# Altium project multimodal_hw_00.PrjPcb (part 1 of 2)
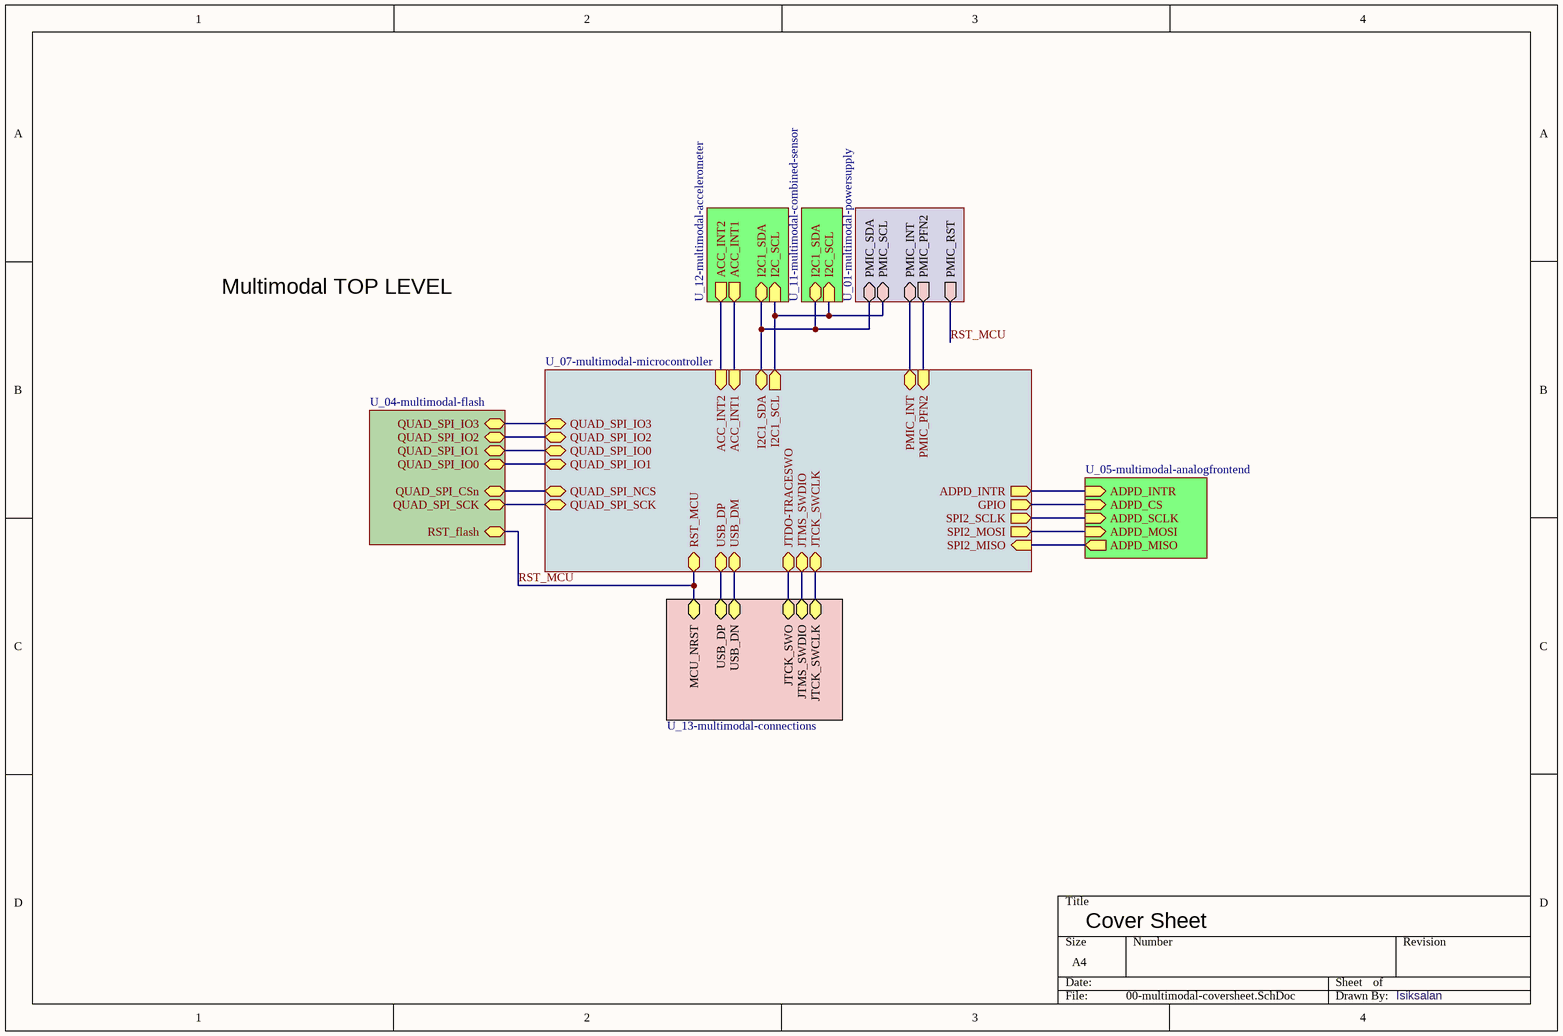
[diagram p0: 00-multimodal-coversheet.SchDoc]
11 sheets, 157 parts. Net scope: hierarchical (ports join the sheet entries above them; power ports are global).
Board file: Multimodal.PcbDoc
Sheets:
  00-multimodal-coversheet.SchDoc
    U_05-multimodal-analogfrontend = 05-multimodal-analogfrontend.SchDoc
      U_06-multimodal-analogfrontend-PPG = 06-multimodal-analogfrontend-PPG.SchDoc
    U_13-multimodal-connections = 13-multimodal-connections.SchDoc
    U_12-multimodal-accelerometer = 12-multimodal-accelerometer.SchDoc
    U_11-multimodal-combined-sensor = 11-multimodal-combined-sensor.SchDoc
    U_04-multimodal-flash = 04-multimodal-flash.SchDoc
    U_01-multimodal-powersupply = 01-multimodal-powersupply.SchDoc
    U_07-multimodal-microcontroller = 07-multimodal-microcontroller.SchDoc
      U_08-multimodal-microcontroller-oscillators = 08-multimodal-microcontroller-oscillators.SchDoc
      U_10-multimodal-microcontroller-rf = 10-multimodal-microcontroller-rf.SchDoc

## Sheet 00-multimodal-coversheet.SchDoc
size A4; SheetNumber: 1; SheetTotal: 11

### Sub-sheets
U_01-multimodal-powersupply = 01-multimodal-powersupply.SchDoc: PMIC_RST (out), PMIC_SDA (bidir), PMIC_SCL (bidir), PMIC_PFN2 (out), PMIC_INT (bidir)
U_04-multimodal-flash = 04-multimodal-flash.SchDoc: QUAD_SPI_CSn (bidir), QUAD_SPI_SCK (bidir), QUAD_SPI_IO0 (bidir), QUAD_SPI_IO1 (bidir), QUAD_SPI_IO2 (bidir), QUAD_SPI_IO3 (bidir), RST_flash (bidir)
U_05-multimodal-analogfrontend = 05-multimodal-analogfrontend.SchDoc: ADPD_INTR (in), ADPD_CS (in), ADPD_SCLK (in), ADPD_MISO (out), ADPD_MOSI (in)
U_07-multimodal-microcontroller = 07-multimodal-microcontroller.SchDoc: QUAD_SPI_IO3 (bidir), QUAD_SPI_IO2 (bidir), QUAD_SPI_IO0 (bidir), QUAD_SPI_IO1 (bidir), SPI2_MOSI (out), SPI2_MISO (in), SPI2_SCLK (out), I2C1_SCL (out), I2C1_SDA (bidir), USB_DP (bidir), USB_DM (bidir), QUAD_SPI_NCS (bidir), QUAD_SPI_SCK (bidir), JTDO-TRACESWO (bidir), JTCK_SWCLK (bidir), JTMS_SWDIO (bidir), RST_MCU (bidir), GPIO (out), ADPD_INTR (out), ACC_INT2 (in), ACC_INT1 (in), PMIC_PFN2 (in), PMIC_INT (bidir)
U_11-multimodal-combined-sensor = 11-multimodal-combined-sensor.SchDoc: I2C1_SDA (bidir), I2C_SCL (in)
U_12-multimodal-accelerometer = 12-multimodal-accelerometer.SchDoc: ACC_INT1 (out), ACC_INT2 (out), I2C1_SDA (bidir), I2C_SCL (in)
U_13-multimodal-connections = 13-multimodal-connections.SchDoc: JTCK_SWCLK (bidir), USB_DN (bidir), USB_DP (bidir), JTMS_SWDIO (bidir), MCU_NRST (bidir), JTCK_SWO (bidir)

### Nets
ACC_INT1: sheet U_12-multimodal-accelerometer/ACC_INT1, sheet U_07-multimodal-microcontroller/ACC_INT1
ACC_INT2: sheet U_12-multimodal-accelerometer/ACC_INT2, sheet U_07-multimodal-microcontroller/ACC_INT2
ADPD_INTR: sheet U_05-multimodal-analogfrontend/ADPD_INTR, sheet U_07-multimodal-microcontroller/ADPD_INTR
I2C1_SCL: sheet U_12-multimodal-accelerometer/I2C_SCL, sheet U_11-multimodal-combined-sensor/I2C_SCL, sheet U_01-multimodal-powersupply/PMIC_SCL, sheet U_07-multimodal-microcontroller/I2C1_SCL
I2C1_SDA: sheet U_12-multimodal-accelerometer/I2C1_SDA, sheet U_11-multimodal-combined-sensor/I2C1_SDA, sheet U_01-multimodal-powersupply/PMIC_SDA, sheet U_07-multimodal-microcontroller/I2C1_SDA
INT: sheet U_01-multimodal-powersupply/PMIC_INT, sheet U_07-multimodal-microcontroller/PMIC_INT
PFN2: sheet U_01-multimodal-powersupply/PMIC_PFN2, sheet U_07-multimodal-microcontroller/PMIC_PFN2
QUAD_SPI_CSn: sheet U_04-multimodal-flash/QUAD_SPI_CSn, sheet U_07-multimodal-microcontroller/QUAD_SPI_NCS
QUAD_SPI_IO0: sheet U_04-multimodal-flash/QUAD_SPI_IO0, sheet U_07-multimodal-microcontroller/QUAD_SPI_IO1
QUAD_SPI_IO1: sheet U_04-multimodal-flash/QUAD_SPI_IO1, sheet U_07-multimodal-microcontroller/QUAD_SPI_IO0
QUAD_SPI_IO2: sheet U_04-multimodal-flash/QUAD_SPI_IO2, sheet U_07-multimodal-microcontroller/QUAD_SPI_IO2
QUAD_SPI_IO3: sheet U_04-multimodal-flash/QUAD_SPI_IO3, sheet U_07-multimodal-microcontroller/QUAD_SPI_IO3
QUAD_SPI_SCK: sheet U_04-multimodal-flash/QUAD_SPI_SCK, sheet U_07-multimodal-microcontroller/QUAD_SPI_SCK
RST_MCU: sheet U_13-multimodal-connections/MCU_NRST, sheet U_04-multimodal-flash/RST_flash, sheet U_01-multimodal-powersupply/PMIC_RST, sheet U_07-multimodal-microcontroller/RST_MCU
NetCR1_1: sheet U_13-multimodal-connections/USB_DP, sheet U_07-multimodal-microcontroller/USB_DP
NetCR1_3: sheet U_13-multimodal-connections/USB_DN, sheet U_07-multimodal-microcontroller/USB_DM
NetJ1_02: sheet U_13-multimodal-connections/JTMS_SWDIO, sheet U_07-multimodal-microcontroller/JTMS_SWDIO
NetJ1_04: sheet U_13-multimodal-connections/JTCK_SWCLK, sheet U_07-multimodal-microcontroller/JTCK_SWCLK
NetJ1_06: sheet U_13-multimodal-connections/JTCK_SWO, sheet U_07-multimodal-microcontroller/JTDO-TRACESWO
NetR24_1: sheet U_05-multimodal-analogfrontend/ADPD_CS, sheet U_07-multimodal-microcontroller/GPIO
NetU5_A1: sheet U_05-multimodal-analogfrontend/ADPD_SCLK, sheet U_07-multimodal-microcontroller/SPI2_SCLK
NetU5_B1: sheet U_05-multimodal-analogfrontend/ADPD_MISO, sheet U_07-multimodal-microcontroller/SPI2_MISO
NetU5_B2: sheet U_05-multimodal-analogfrontend/ADPD_MOSI, sheet U_07-multimodal-microcontroller/SPI2_MOSI

### Notes on the sheet
- Multimodal TOP LEVEL
- Cover Sheet
- Isiksalan

## Sheet 05-multimodal-analogfrontend.SchDoc
size A3; CompanyName: ICAS Lab.; DrawnBy: Isil Isiksalan; SheetNumber: 3; SheetTotal: 11
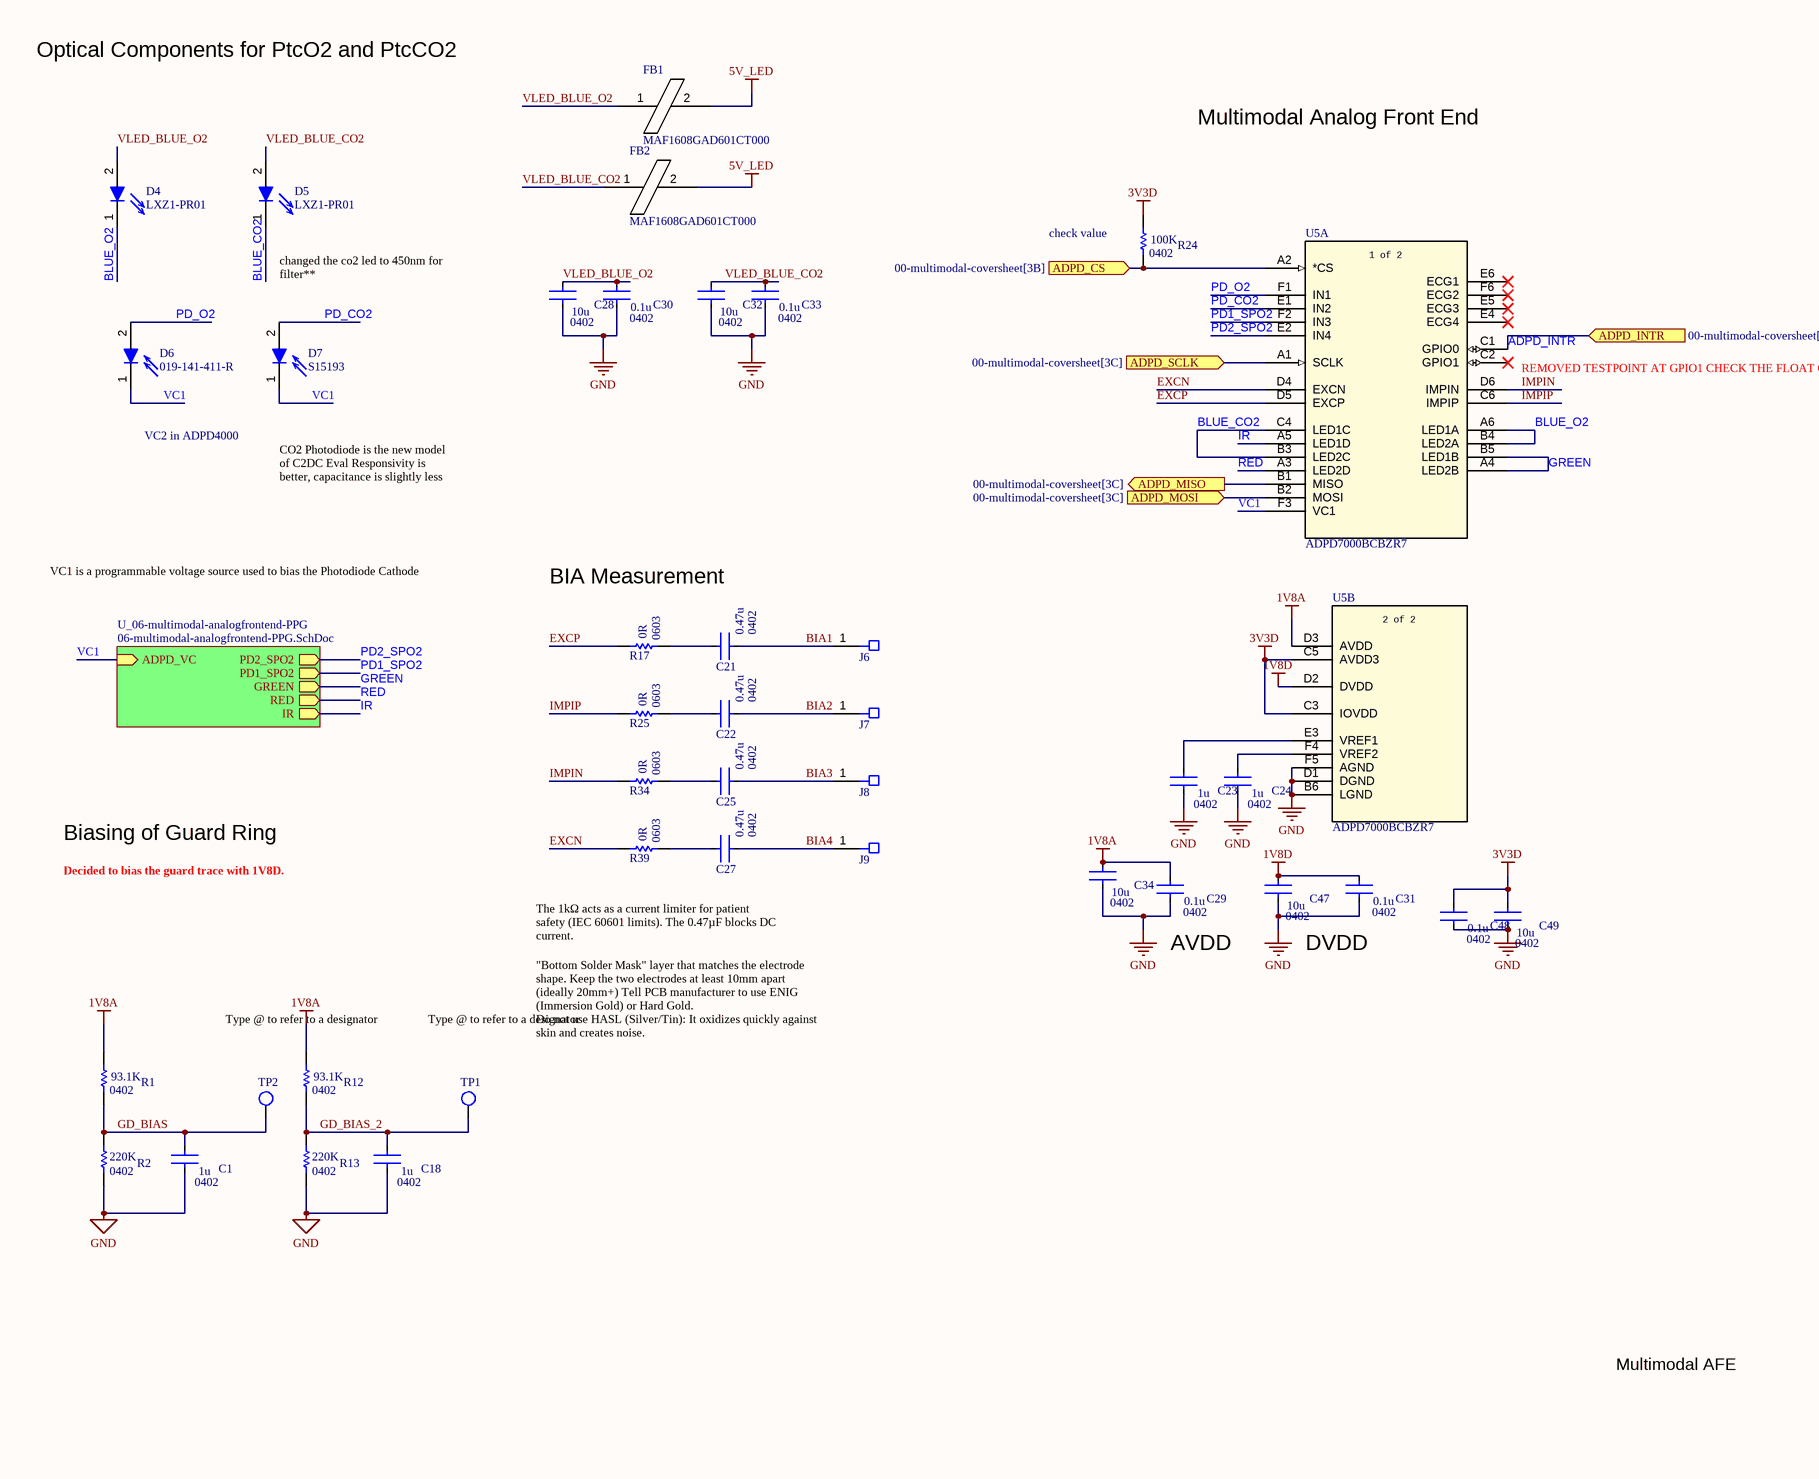
[diagram p1: 05-multimodal-analogfrontend.SchDoc, left]
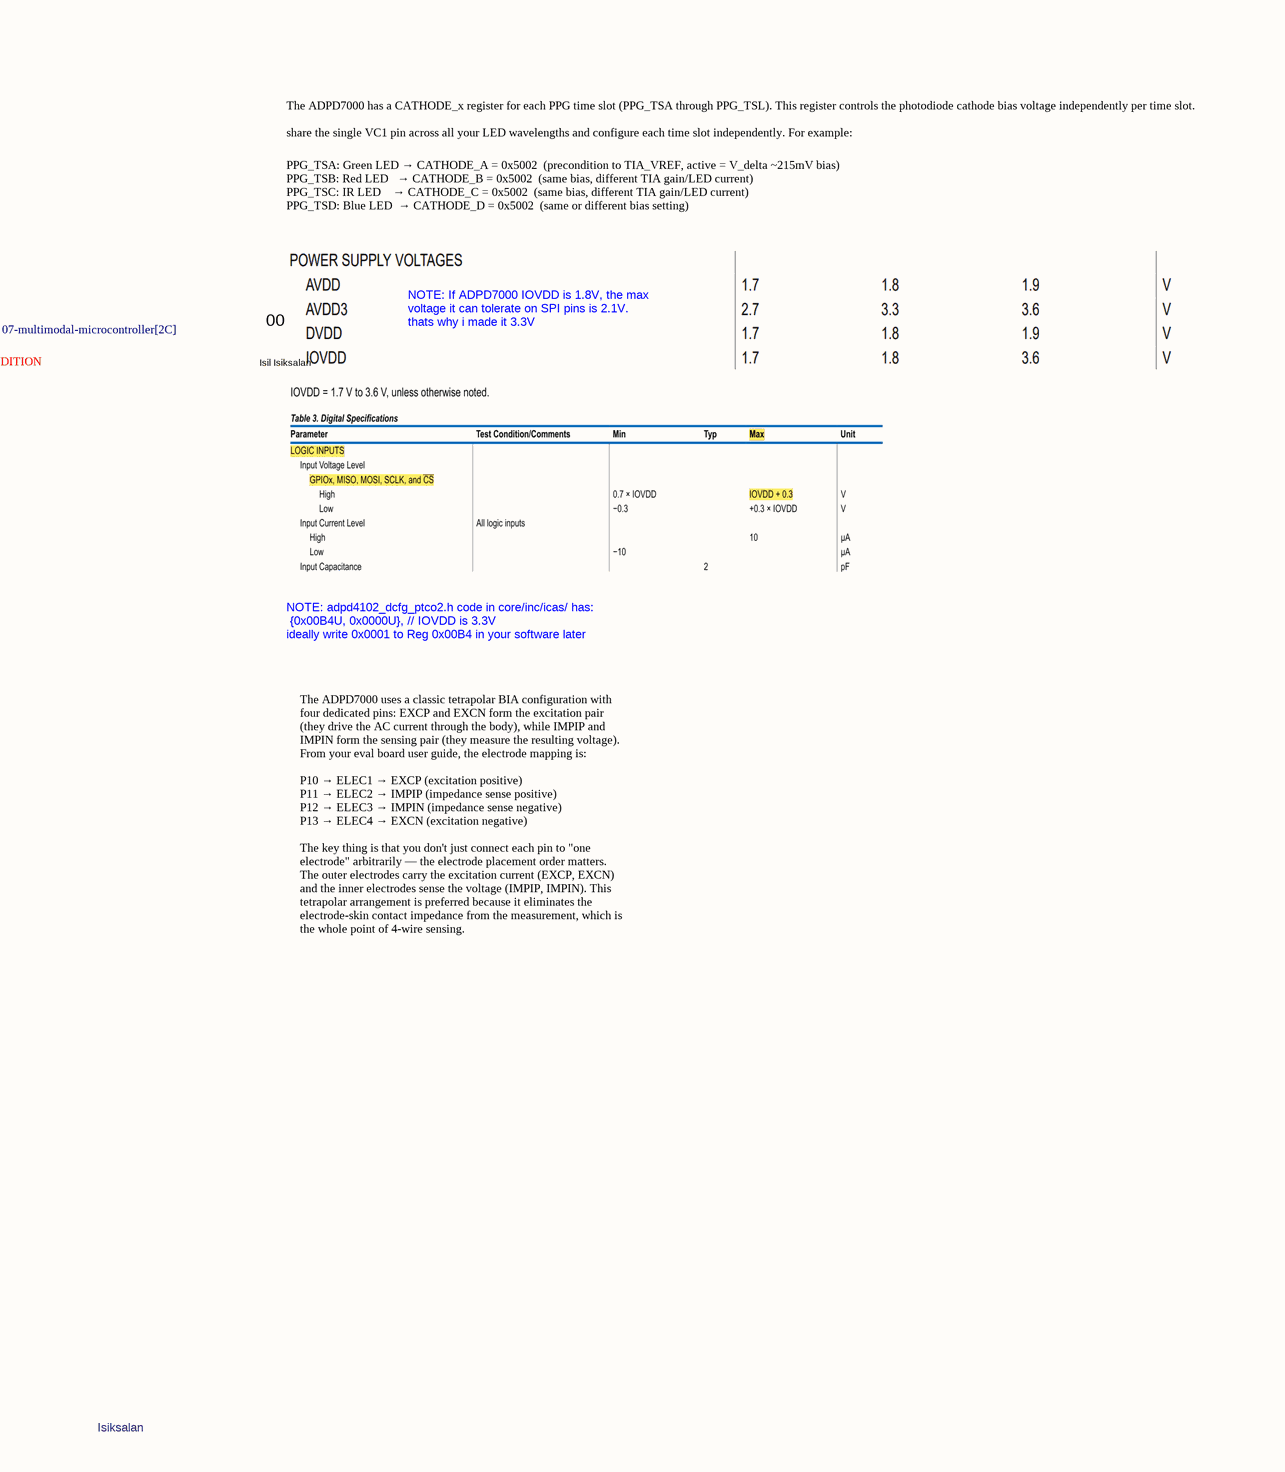
[diagram p2: 05-multimodal-analogfrontend.SchDoc, right]

### Parts
C1  C1005X5R1V105K050BC  [CAPTDK0402]  (value not drawn)
C18  C1005X5R1V105K050BC  [CAPTDK0402]  (value not drawn)
C21  GRM155R60J474KE19D  [CAPTDK0402]  (value not drawn)
C22  GRM155R60J474KE19D  [CAPTDK0402]  (value not drawn)
C23  C1005X5R1V105K050BC  [CAPTDK0402]  (value not drawn)
C24  C1005X5R1V105K050BC  [CAPTDK0402]  (value not drawn)
C25  GRM155R60J474KE19D  [CAPTDK0402]  (value not drawn)
C27  GRM155R60J474KE19D  [CAPTDK0402]  (value not drawn)
C28  0402W106M6R3HI  [CAPTDK0402]  (value not drawn)
C29  C1005X7R1H104K050BB  [CAPTDK0402]  (value not drawn)
C30  C1005X7R1H104K050BB  [CAPTDK0402]  (value not drawn)
C31  C1005X7R1H104K050BB  [CAPTDK0402]  (value not drawn)
C32  0402W106M6R3HI  [CAPTDK0402]  (value not drawn)
C33  C1005X7R1H104K050BB  [CAPTDK0402]  (value not drawn)
C34  GRM155R61A106ME11D  [CAPTDK0402]  (value not drawn)
C47  GRM155R61A106ME11D  [CAPTDK0402]  (value not drawn)
C48  C1005X7R1H104K050BB  [CAPTDK0402]  (value not drawn)
C49  GRM155R61A106ME11D  [CAPTDK0402]  (value not drawn)
D4  LXZ1-PR01  [LXZ1-PR01]
D5  LXZ1-PR01  [LXZ1-PR01]
D6  019-141-411-R  [RED-PD]
D7  S15193  [S15193]
FB1  MAF1608GAD601CT000  [INDMURT0603]
FB2  MAF1608GAD601CT000  [INDMURT0603]
J6  electrode  [electrode]  (value not drawn)
J7  electrode  [electrode]  (value not drawn)
J8  electrode  [electrode]  (value not drawn)
J9  electrode  [electrode]  (value not drawn)
R1  RMCF0402FT93K1  [RES-STACK-POLE-0402]  (value not drawn)
R2  RMCF0402FT220K  [RES-STACK-POLE-0402]  (value not drawn)
R12  RMCF0402FT93K1  [RES-STACK-POLE-0402]  (value not drawn)
R13  RMCF0402FT220K  [RES-STACK-POLE-0402]  (value not drawn)
R17  RMCF0603ZT0R00  [RES-STACK-POLE-0603]  (value not drawn)
R24  RMCF0402FT100K  [RES-STACK-POLE-0402]  (value not drawn)
R25  RMCF0603ZT0R00  [RES-STACK-POLE-0603]  (value not drawn)
R34  RMCF0603ZT0R00  [RES-STACK-POLE-0603]  (value not drawn)
R39  RMCF0603ZT0R00  [RES-STACK-POLE-0603]  (value not drawn)
TP1  TESTPOINT_S  [TESTPOINT_S]  (value not drawn)  (no BOM)
TP2  TESTPOINT_S  [TESTPOINT_S]  (value not drawn)  (no BOM)
U5  ADPD7000BCBZR7  [ADPD7001_36-WLCSP]  (parts A,B of 2)

### Sub-sheets
U_06-multimodal-analogfrontend-PPG = 06-multimodal-analogfrontend-PPG.SchDoc: PD2_SPO2 (out), PD1_SPO2 (out), ADPD_VC (in), GREEN (out), RED (out), IR (out)

### Ports
ADPD_CS (in, see 00-multimodal-coversheet[3B]), ADPD_INTR (in, see 00-multimodal-coversheet[3B], 07-multimodal-microcontroller[2C]), ADPD_MISO (out, see 00-multimodal-coversheet[3C]), ADPD_MOSI (in, see 00-multimodal-coversheet[3C]), ADPD_SCLK (in, see 00-multimodal-coversheet[3C])

### Nets
1V8A: C29.1 C34.1 R1.2 R12.2 U5.D3(AVDD)
1V8D: C31.1 C47.1 U5.D2(DVDD)
3V3D: C48.1 C49.1 R24.2 U5.C3(IOVDD) U5.C5(AVDD3)
5V_LED: FB1.2 FB2.2
GND: C1.2 C18.2 C23.2 C24.2 C28.2 C29.2 C30.2 C31.2 C32.2 C33.2 C34.2 C47.2 C48.2 C49.2 R2.1 R13.1 U5.B6(LGND) U5.D1(DGND) U5.F5(AGND)
ADPD_INTR: U5.C1(GPIO0) ; port ADPD_INTR
BIA1: C21.2 J6.1
BIA2: C22.2 J7.1
BIA3: C25.2 J8.1
BIA4: C27.2 J9.1
BLUE_CO2: D5.1 U5.B3(LED2C) U5.C4(LED1C)
BLUE_O2: D4.1 U5.A6(LED1A) U5.B4(LED2A)
EXCN: R39.2 U5.D4(EXCN)
EXCP: R17.2 U5.D5(EXCP)
GD_BIAS: C1.1 R1.1 R2.2 TP2.1
GD_BIAS_2: C18.1 R12.1 R13.2 TP1.1
GREEN: U5.A4(LED2B) U5.B5(LED1B) ; sheet U_06-multimodal-analogfrontend-PPG/GREEN
IMPIN: R34.2 U5.D6(IMPIN)
IMPIP: R25.2 U5.C6(IMPIP)
IR: U5.A5(LED1D) ; sheet U_06-multimodal-analogfrontend-PPG/IR
PD1_SPO2: U5.F2(IN3) ; sheet U_06-multimodal-analogfrontend-PPG/PD1_SPO2
PD2_SPO2: U5.E2(IN4) ; sheet U_06-multimodal-analogfrontend-PPG/PD2_SPO2
PD_CO2: D7.2 U5.E1(IN2)
PD_O2: D6.2 U5.F1(IN1)
RED: U5.A3(LED2D) ; sheet U_06-multimodal-analogfrontend-PPG/RED
VC1: D6.1 D7.1 U5.F3(VC1) ; sheet U_06-multimodal-analogfrontend-PPG/ADPD_VC
VLED_BLUE_CO2: C32.1 C33.1 D5.2 FB2.1
VLED_BLUE_O2: C28.1 C30.1 D4.2 FB1.1
NetC21_1: C21.1 R17.1
NetC22_1: C22.1 R25.1
NetC23_1: C23.1 U5.E3(VREF1)
NetC24_1: C24.1 U5.F4(VREF2)
NetC25_1: C25.1 R34.1
NetC27_1: C27.1 R39.1
NetR24_1: R24.1 U5.A2(*CS) ; port ADPD_CS
NetU5_A1: U5.A1(SCLK) ; port ADPD_SCLK
NetU5_B1: U5.B1(MISO) ; port ADPD_MISO
NetU5_B2: U5.B2(MOSI) ; port ADPD_MOSI

Not connected (* = marked no-connect by the designer): U5 C2(GPIO1)* E4(ECG4)* E5(ECG3)* E6(ECG1)* F6(ECG2)*

### Notes on the sheet
- Optical Components for PtcO2 and PtcCO2
- Multimodal Analog Front End
- The ADPD7000 has a CATHODE_x register for each PPG time slot (PPG_TSA through PPG_TSL). This register controls the photodiode cathode bias voltage independently per time slot.
- share the single VC1 pin across all your LED wavelengths and configure each time slot independently. For example:
- changed the co2 led to 450nm for filter**
- (near R24) check value
- PPG_TSA: Green LED → CATHODE_A = 0x5002  (precondition to TIA_VREF, active = V_delta ~215mV bias)
  PPG_TSB: Red LED   → CATHODE_B = 0x5002  (same bias, different TIA gain/LED current)
  PPG_TSC: IR LED    → CATHODE_C = 0x5002  (same bias, different TIA gain/LED current)
  PPG_TSD: Blue LED  → CATHODE_D = 0x5002  (same or different bias setting)
- 00
- NOTE: If ADPD7000 IOVDD is 1.8V, the max voltage it can tolerate on SPI pins is 2.1V. thats why i made it 3.3V
- REMOVED TESTPOINT AT GPIO1 CHECK THE FLOAT CONDITION
- Isil Isiksalan
- VC2 in ADPD4000
- CO2 Photodiode is the new model of C2DC Eval Responsivity is better, capacitance is slightly less
- VC1 is a programmable voltage source used to bias the Photodiode Cathode
- BIA Measurement
- NOTE: adpd4102_dcfg_ptco2.h code in core/inc/icas/ has:
  {0x00B4U, 0x0000U}, // IOVDD is 3.3V
  ideally write 0x0001 to Reg 0x00B4 in your software later
- Biasing of Guard Ring
- Decided to bias the guard trace with 1V8D.
- (near C29) AVDD
- DVDD
- The ADPD7000 uses a classic tetrapolar BIA configuration with four dedicated pins: EXCP and EXCN form the excitation pair (they drive the AC current through the body), while IMPIP and IMPIN form the sensing pair (they measure the resulting voltage). From your eval board user guide, the electrode mapping is:
  P10 → ELEC1 → EXCP (excitation positive)
  P11 → ELEC2 → IMPIP (impedance sense positive)
  P12 → ELEC3 → IMPIN (impedance sense negative)
  P13 → ELEC4 → EXCN (excitation negative)
  The key thing is that you don't just connect each pin to "one electrode" arbitrarily — the electrode placement order matters. The outer electrodes carry the excitation current (EXCP, EXCN) and the inner electrodes sense the voltage (IMPIP, IMPIN). This tetrapolar arrangement is preferred because it eliminates the electrode-skin contact impedance from the measurement, which is the whole point of 4-wire sensing.
- Type @ to refer to a designator
- The 1kΩ acts as a current limiter for patient safety (IEC 60601 limits). The 0.47µF blocks DC current.
- "Bottom Solder Mask" layer that matches the electrode shape. Keep the two electrodes at least 10mm apart (ideally 20mm+) Tell PCB manufacturer to use ENIG (Immersion Gold) or Hard Gold.
  Do not use HASL (Silver/Tin): It oxidizes quickly against skin and creates noise.
- Multimodal AFE
- Isiksalan
- THIS DOCUMENT AND THE DATA DISCLOSED HEREIN OR
- HEREWITH IS THE PROPERTY OF ALTIUM LIMITED AND MAY
- DWG NO:
- REVISION
- REV:
- DESCRIPTION
- DATE
- APPROVED
- BE FREELY DISTRIBUTED IN WHOLE. NO RIGHTS ARE
- RESERVED OR EXPRESS OR IMPLIED WARANTEE GIVEN.
- ENG:
- APPROVALS
- PROJECT
- DSN:
- CHK:
- REFERENCE DOCUMENTS
- PROJECT REVISION:
- TITLE
- DOCUMENT REVISION:
- DESIGN ITEM:
- BOM:
- FAB DWG:
- PCB DWG:
- ASSY DWG:
- SCALE:
- A3
- SIZE
- CAGE CODE
- FILE NAME
- DWG NO.
- SHEET
- OF
- REV
- (in symbol 0402W106M6R3HI) 10u; 0402
- (in symbol ADPD7000BCBZR7, part A) 1 of 2
- (in symbol ADPD7000BCBZR7, part B) 2 of 2
- (in symbol C1005X5R1V105K050BC) 1u; 0402
- (in symbol C1005X7R1H104K050BB) 0.1u; 0402
- (in symbol GRM155R60J474KE19D) 0.47u; 0402
- (in symbol GRM155R61A106ME11D) 10u; 0402
- (in symbol RMCF0402FT93K1) 93.1K; 0402
- (in symbol RMCF0402FT100K) 100K; 0402
- (in symbol RMCF0402FT220K) 220K; 0402
- (in symbol RMCF0603ZT0R00) 0R; 0603

### Library data of the parts
C1 C18 C23 C24 = C1005X5R1V105K050BC: CAP CER 1UF 35V X5R 0402; Supplier 1: Digi-Key; Supplier Part Number 1: 445-9073-1-ND
C21 C22 C25 C27 = GRM155R60J474KE19D: CAP CER 0.47UF 6.3V X5R 0402; Supplier 1: Avnet; Supplier Part Number 1: GRM155R60J474KE19D
C28 C32 = 0402W106M6R3HI: CAP SMD,0402,X5R,10UF,20%,6.3V
C29-C31 C33 C48 = C1005X7R1H104K050BB: CAP CER 0.1UF 50V X7R 0402; Supplier 1: Digi-Key; Supplier Part Number 1: 445-5932-1-ND
C34 C47 C49 = GRM155R61A106ME11D: CAP CER 10UF 10V X5R 0402; Supplier 1: Digi-Key; Supplier Part Number 1: 490-GRM155R61A106ME11DCT-ND
D4 D5 = LXZ1-PR01: LED LUXEON Z RYL BLUE 450NM 2SMD; Manufacturer: Philips Lumileds; Wavelength: 447.5nm; Forward Current: 500mA; Viewing Angle: 125°; Number of LEDs: 1; Forward Voltage: 2.9V; Lens Style: Rectangular,Round; Supplier 1: Digi-Key; Manufacturer Part Number: LXZ1-PR01; RoHS: Yes; Category: LEDs; Stock 1: 4609; Pricing 1: 1=2.57000, 10=1.71400, 100=1.31940, 500=1.19264, 1000=1.16469 (USD); Mount: Surface Mount; Case/Package: SMD/SMT; Number of Pins: 2; Color: Blue; Lens Color: Blue; Min Operating Temperature: -40°C; Max Operating Temperature: 135°C; Dominant Wavelength: 447.5nm; Test Current: 500mA; Illumination Color: Blue; Packaging: Tape and Reel; Package Quantity: 2000; Length: 1.7mm; Width: 1.3mm; Height: 0.66mm; Lead Free: Lead Free; ComponentLink1URL: https://datasheet.ciiva.com/25632/0900766b81251f28-25632625.pdf?src-supplier=RSComponents; ComponentLink1Description: https://datasheet.ciiva.com/25632/0900766b81251f28-25632625.pdf?src-supplier=RSComponents; ComponentLink2URL: https://datasheet.ciiva.com/16345/ds105-16345515.pdf?src-supplier=Future+Electronics; ComponentLink2Description: https://datasheet.ciiva.com/16345/ds105-16345515.pdf?src-supplier=Future+Electronics; Supplier Part Number 1: 1416-1058-1-ND
D6 = 019-141-411-R: PHOTODIODE RED MICRO SMT; Supplier 1: Digi-Key; Supplier Part Number 1: 209-019-141-411-RCT-ND
D7 = S15193: PHOTODIODE PIN 380 NM-1000 NM 20V 0.64 A/W SMD; Manufacturer: Hamamatsu; ComponentLink1Description: Datasheet; ComponentLink1URL: https://www.hamamatsu.com/resources/pdf/ssd/s13773_kpin1088e.pdf; Manufacturer Part Number: S15193; Supplier 1: Hamamatsu; Supplier 1 Part Number: S15193
FB1 FB2 = MAF1608GAD601CT000: FERRITE BEAD 120 OHM 0603 1LN; Supplier 1: Newark; Supplier Part Number 1: MAF1608GAD601CT000
J6-J9 = electrode: one pad opening
R1 R12 = RMCF0402FT93K1: RES 93.1K OHM 1% 1/16W 0402; Mfr_Name: Stackpole International; Manufacturer_Part_Number: RMCF0603FT80K6; Copyright: Copyright (C) 2022 Ultra Librarian. All rights reserved.; Digi-Key_Part_Number_1: RMCF0603FT80K6CT-ND; Digi-Key_Part_Number_2: RMCF0603FT80K6DKR-ND; Digi-Key_Part_Number_3: RMCF0603FT80K6TR-ND; RefDes: RefDes; Type: DEV; Supplier 1: Digi-Key; Supplier Part Number 1: RMCF0402FT93K1CT-ND
R2 R13 = RMCF0402FT220K: RES 220K OHM 1% 1/16W 0402; Supplier 1: Digi-Key; Supplier Part Number 1: RMCF0402FT220KCT-ND
R17 R25 R34 R39 = RMCF0603ZT0R00: RES 0 OHM JUMPER 1/10W 0603; Supplier 1: Digi-Key; Supplier Part Number 1: RMCF0603ZT0R00CT-ND
R24 = RMCF0402FT100K: RES 100K OHM 1% 1/16W 0402; Supplier 1: Digi-Key; Supplier Part Number 1: RMCF0402FT100KCT-ND
TP1 TP2 = TESTPOINT_S: Testpoint Surface Pad
U5 = ADPD7000BCBZR7: Multimodal Sensor Front End; Manufacturer_Name: Analog Devices Inc; Type: Interface; Copyright: Copyright (C) 2026 Ultra Librarian. All rights reserved.; Manufacturer_Part_Number: ADPD7000BCBZR7; RefDes: RefDes

## Sheet 06-multimodal-analogfrontend-PPG.SchDoc
size A; SheetNumber: 4; SheetTotal: 11
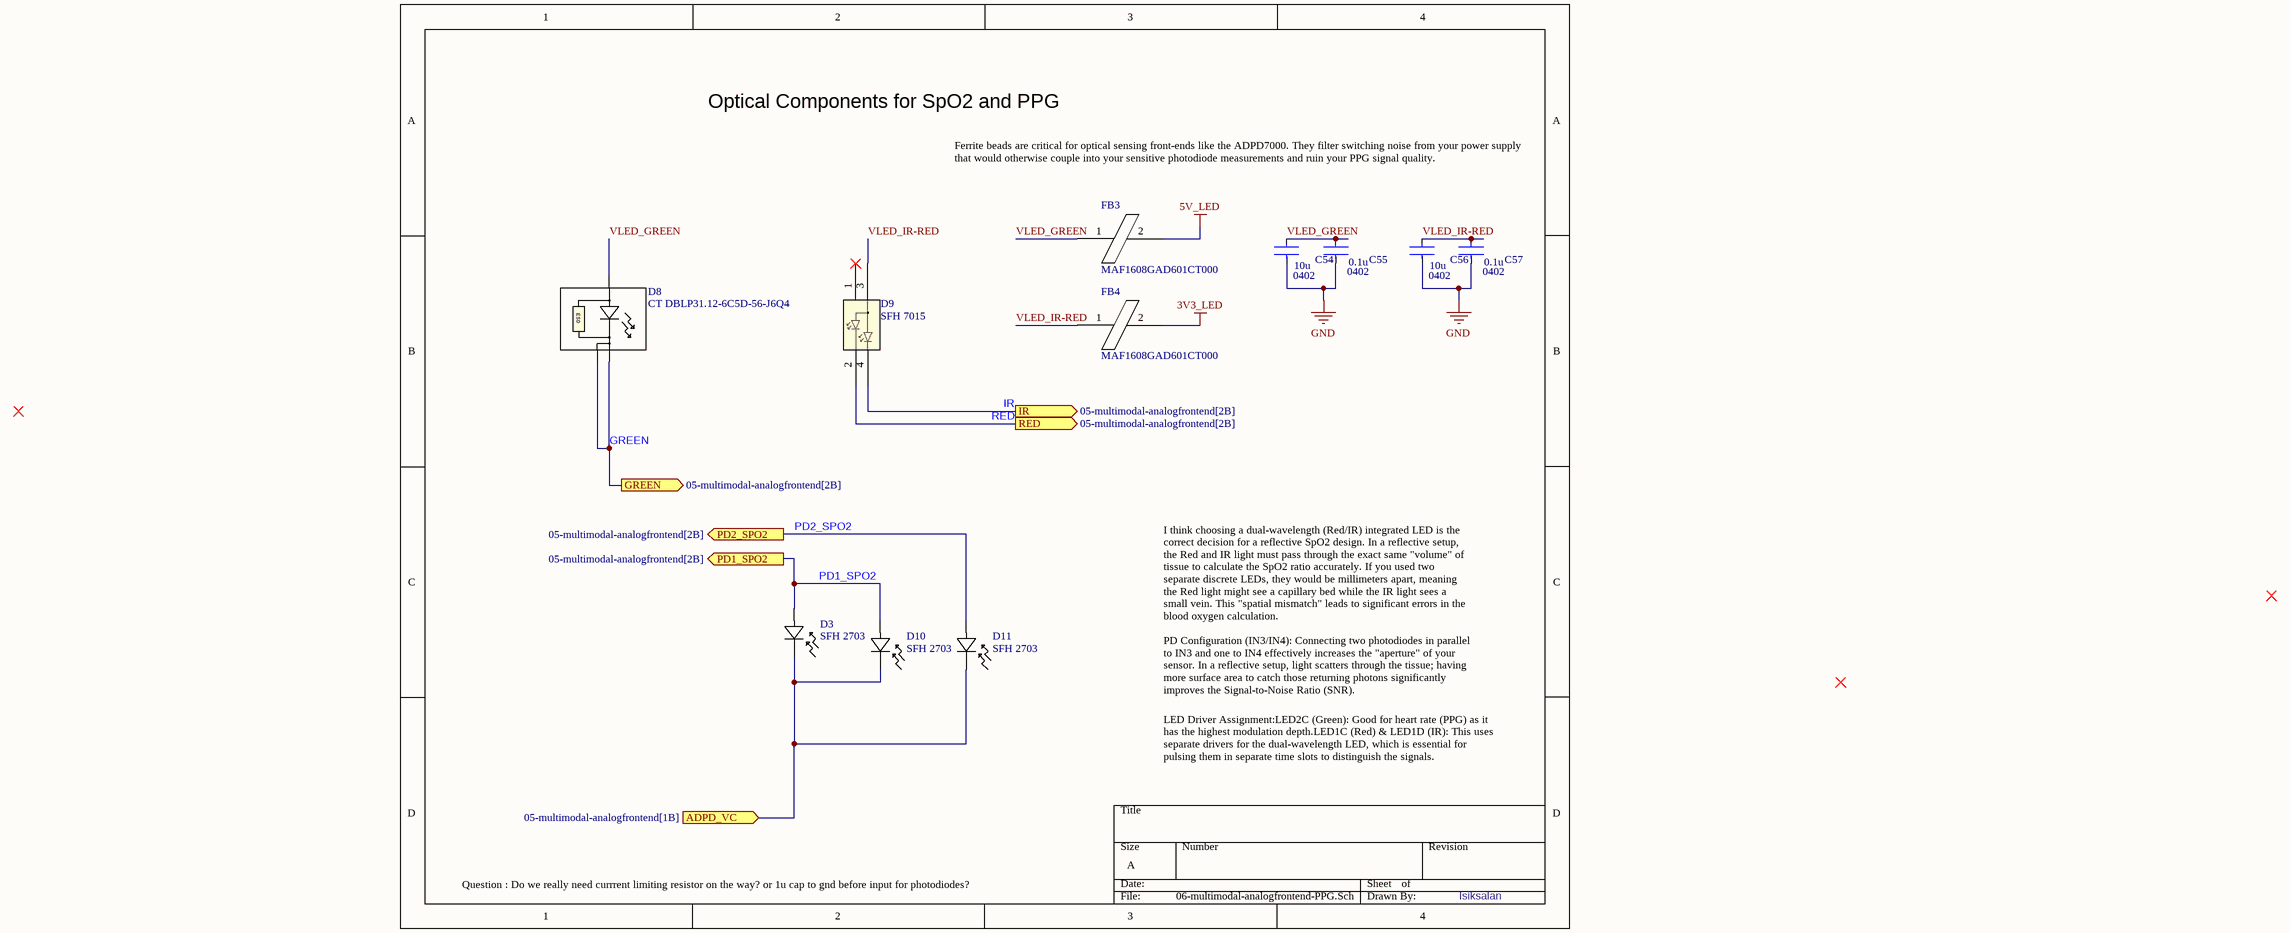
[diagram p3: 06-multimodal-analogfrontend-PPG.SchDoc]

### Parts
C54  0402W106M6R3HI  [CAPTDK0402]  (value not drawn)
C55  C1005X7R1H104K050BB  [CAPTDK0402]  (value not drawn)
C56  0402W106M6R3HI  [CAPTDK0402]  (value not drawn)
C57  C1005X7R1H104K050BB  [CAPTDK0402]  (value not drawn)
D3  SFH 2703  [LED_SFH 2703_OSR]
D8  CT DBLP31.12-6C5D-56-J6Q4  [CT DBLP31.12-6C5D-56-J6Q4_OSR]
D9  SFH 7015  [SFH 7015_OSR]
D10  SFH 2703  [LED_SFH 2703_OSR]
D11  SFH 2703  [LED_SFH 2703_OSR]
FB3  MAF1608GAD601CT000  [INDMURT0603]
FB4  MAF1608GAD601CT000  [INDMURT0603]

### Ports
ADPD_VC (in, see 05-multimodal-analogfrontend[1B]), GREEN (out, see 05-multimodal-analogfrontend[2B]), IR (out, see 05-multimodal-analogfrontend[2B]), PD1_SPO2 (out, see 05-multimodal-analogfrontend[2B]), PD2_SPO2 (out, see 05-multimodal-analogfrontend[2B]), RED (out, see 05-multimodal-analogfrontend[2B])

### Nets
3V3_LED: FB4.2
5V_LED: FB3.2
GND: C54.2 C55.2 C56.2 C57.2
GREEN: D8.1 D8.3 ; port GREEN
IR: D9.4 ; port IR
PD1_SPO2: D3.2 D10.2 ; port PD1_SPO2
PD2_SPO2: D11.2 ; port PD2_SPO2
RED: D9.2 ; port RED
VC1: D3.1 D10.1 D11.1 ; port ADPD_VC
VLED_GREEN: C54.1 C55.1 D8.2 FB3.1
VLED_IR-RED: C56.1 C57.1 D9.3 FB4.1

Not connected (* = marked no-connect by the designer): D9 1*

### Notes on the sheet
- Optical Components for SpO2 and PPG
- Ferrite beads are critical for optical sensing front-ends like the ADPD7000. They filter switching noise from your power supply that would otherwise couple into your sensitive photodiode measurements and ruin your PPG signal quality.
- I think choosing a dual-wavelength (Red/IR) integrated LED is the correct decision for a reflective SpO2 design. In a reflective setup, the Red and IR light must pass through the exact same "volume" of tissue to calculate the SpO2 ratio accurately. If you used two separate discrete LEDs, they would be millimeters apart, meaning the Red light might see a capillary bed while the IR light sees a small vein. This "spatial mismatch" leads to significant errors in the blood oxygen calculation.
- PD Configuration (IN3/IN4): Connecting two photodiodes in parallel to IN3 and one to IN4 effectively increases the "aperture" of your sensor. In a reflective setup, light scatters through the tissue; having more surface area to catch those returning photons significantly improves the Signal-to-Noise Ratio (SNR).
- LED Driver Assignment:LED2C (Green): Good for heart rate (PPG) as it has the highest modulation depth.LED1C (Red) & LED1D (IR): This uses separate drivers for the dual-wavelength LED, which is essential for pulsing them in separate time slots to distinguish the signals.
- Question : Do we really need currrent limiting resistor on the way? or 1u cap to gnd before input for photodiodes?
- Isiksalan
- (in symbol 0402W106M6R3HI) 10u; 0402
- (in symbol C1005X7R1H104K050BB) 0.1u; 0402
- (in symbol CT DBLP31.12-6C5D-56-J6Q4) ESD

### Library data of the parts
C54 C56 = 0402W106M6R3HI: CAP SMD,0402,X5R,10UF,20%,6.3V
C55 C57 = C1005X7R1H104K050BB: CAP CER 0.1UF 50V X7R 0402; Supplier 1: Digi-Key; Supplier Part Number 1: 445-5932-1-ND
D3 D10 D11 = SFH 2703: SENSOR PHOTODIODE 940NM 2SMD; Manufacturer_Name: ams OSRAM; Copyright: Copyright (C) 2025 Ultra Librarian. All rights reserved.; Manufacturer_Part_Number: SFH 2703; Supplier 1: Avnet; Supplier Part Number 1: Q65112A8147
D8 = CT DBLP31.12-6C5D-56-J6Q4: LED GREEN CLEAR SMD Green 536nm LED Indication - Discrete 2.3V 3-SMD, No Lead; Manufacturer_Name: ams OSRAM; Copyright: Copyright (C) 2025 Ultra Librarian. All rights reserved.; Manufacturer_Part_Number: CT DBLP31.12-6C5D-56-J6Q4; Supplier 1: Avnet; Supplier Part Number 1: Q65112A4607
D9 = SFH 7015: Multi-Color LEDs Red / IR LED 655nm / 940nm; Manufacturer_Name: ams OSRAM; Copyright: Copyright (C) 2026 Ultra Librarian. All rights reserved.; Manufacturer_Part_Number: SFH 7015; RefDes: RefDes; Type: Type; Supplier 1: Avnet; Supplier Part Number 1: Q65113A4161
FB3 FB4 = MAF1608GAD601CT000: FERRITE BEAD 120 OHM 0603 1LN; Supplier 1: Newark; Supplier Part Number 1: MAF1608GAD601CT000

## Sheet 13-multimodal-connections.SchDoc
size A; SheetNumber: 10; SheetTotal: 11
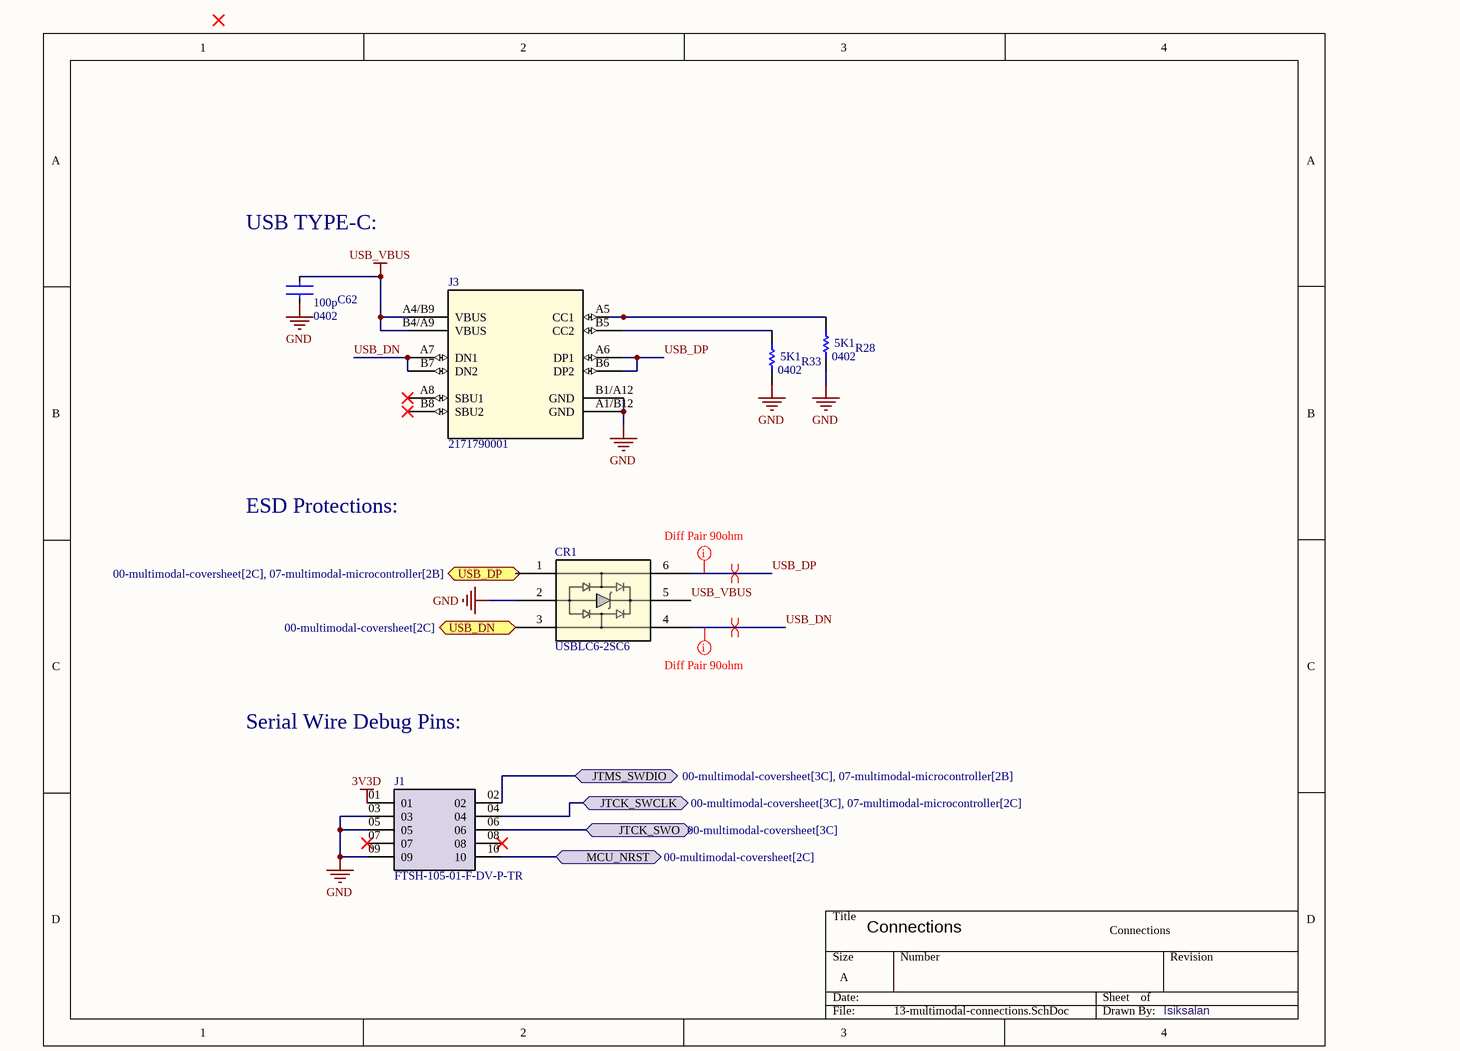
[diagram p4: 13-multimodal-connections.SchDoc]

### Parts
C62  CGA2B2C0G1H101J050BA  [CAPTDK0402]  (value not drawn)
CR1  USBLC6-2SC6  [SOT-23]
J1  FTSH-105-01-F-DV-P-TR  [SAMTEC_FTSH-105-01-F-DV-P-TR]
J3  2171790001  [2171790001_MOL]
R28  ERA-2AEB512X  [RES-STACK-POLE-0402]  (value not drawn)
R33  ERA-2AEB512X  [RES-STACK-POLE-0402]  (value not drawn)

### Ports
JTCK_SWCLK (bidir, see 00-multimodal-coversheet[3C], 07-multimodal-microcontroller[2C]), JTCK_SWO (bidir, see 00-multimodal-coversheet[3C]), JTMS_SWDIO (bidir, see 00-multimodal-coversheet[3C], 07-multimodal-microcontroller[2B]), MCU_NRST (bidir, see 00-multimodal-coversheet[2C]), USB_DN (bidir, see 00-multimodal-coversheet[2C]), USB_DP (bidir, see 00-multimodal-coversheet[2C], 07-multimodal-microcontroller[2B])

### Nets
3V3D: J1.01
GND: C62.2 CR1.2 J1.03 J1.05 J1.09 J3.A1/B12(GND) J3.B1/A12(GND) R28.1 R33.1
USB_VBUS: C62.1 CR1.5 J3.A4/B9(VBUS) J3.B4/A9(VBUS)
RST_MCU: J1.10 ; port MCU_NRST
USB_DN: CR1.4 J3.A7(DN1) J3.B7(DN2)
USB_DP: CR1.6 J3.A6(DP1) J3.B6(DP2)
NetCR1_1: CR1.1 ; port USB_DP
NetCR1_3: CR1.3 ; port USB_DN
NetJ1_02: J1.02 ; port JTMS_SWDIO
NetJ1_04: J1.04 ; port JTCK_SWCLK
NetJ1_06: J1.06 ; port JTCK_SWO
NetJ3_A5: J3.A5(CC1) R28.2
NetJ3_B5: J3.B5(CC2) R33.2

Not connected (* = marked no-connect by the designer): J1 07* 08*; J3 A8(SBU1)* B8(SBU2)*

### Layout directives
differential pair: USB_DN, USB_DP
mark named Diff Pair 90ohm: USB_DN, USB_DP

### Notes on the sheet
- (near C62) USB TYPE-C:
- ESD Protections:
- Serial Wire Debug Pins:
- Connections
- Isiksalan
- (in symbol CGA2B2C0G1H101J050BA) 100p; 0402
- (in symbol ERA-2AEB512X) 5K1; 0402

### Library data of the parts
C62 = CGA2B2C0G1H101J050BA: CAP CER 100PF 50V C0G 0402; Supplier 1: Digi-Key; Supplier Part Number 1: 445-5596-1-ND
CR1 = USBLC6-2SC6: ESD Protection for USB 2.0 High Speed; Manufacturer_Name: STMicroelectronics; Copyright: Copyright (C) 2025 Ultra Librarian. All rights reserved.; Manufacturer_Part_Number: USBLC6-2SC6; RefDes: RefDes; Type: Type; Supplier 1: Avnet; Supplier Part Number 1: USBLC6-2SC6
J1 = FTSH-105-01-F-DV-P-TR: Connector Header Surface Mount 10 position 0.050" (1.27mm); MF: Samtec Inc.; MP: FTSH-105-01-F-DV-K-TR; SnapEDA_Link: https://www.snapeda.com/parts/FTSH-105-01-F-DV-K-TR/Samtec/view-part/?ref=snap; Package: None; Value: *; Check_prices: https://www.snapeda.com/parts/FTSH-105-01-F-DV-K-TR/Samtec/view-part/?ref=eda
J3 = 2171790001: Universal Serial Bus (USB) Shielded I/O Receptacle, Type C, Right-Angle, Top Mount, Surface Mount, Single Row, 16 Circuits, Gold (Au) Plating; Manufacturer_Name: Molex Connector Corporation; Copyright: Copyright (C) 2025 Ultra Librarian. All rights reserved.; Manufacturer_Part_Number: 2171790001; RefDes: RefDes; Type: Type
R28 R33 = ERA-2AEB512X: RES SMD 5.1K OHM 0.1% 1/16W 0402; Supplier 1: Arrow Electronics; Supplier Part Number 1: ERA-2AEB512X

## Sheet 12-multimodal-accelerometer.SchDoc
size A; SheetNumber: 9; SheetTotal: 11
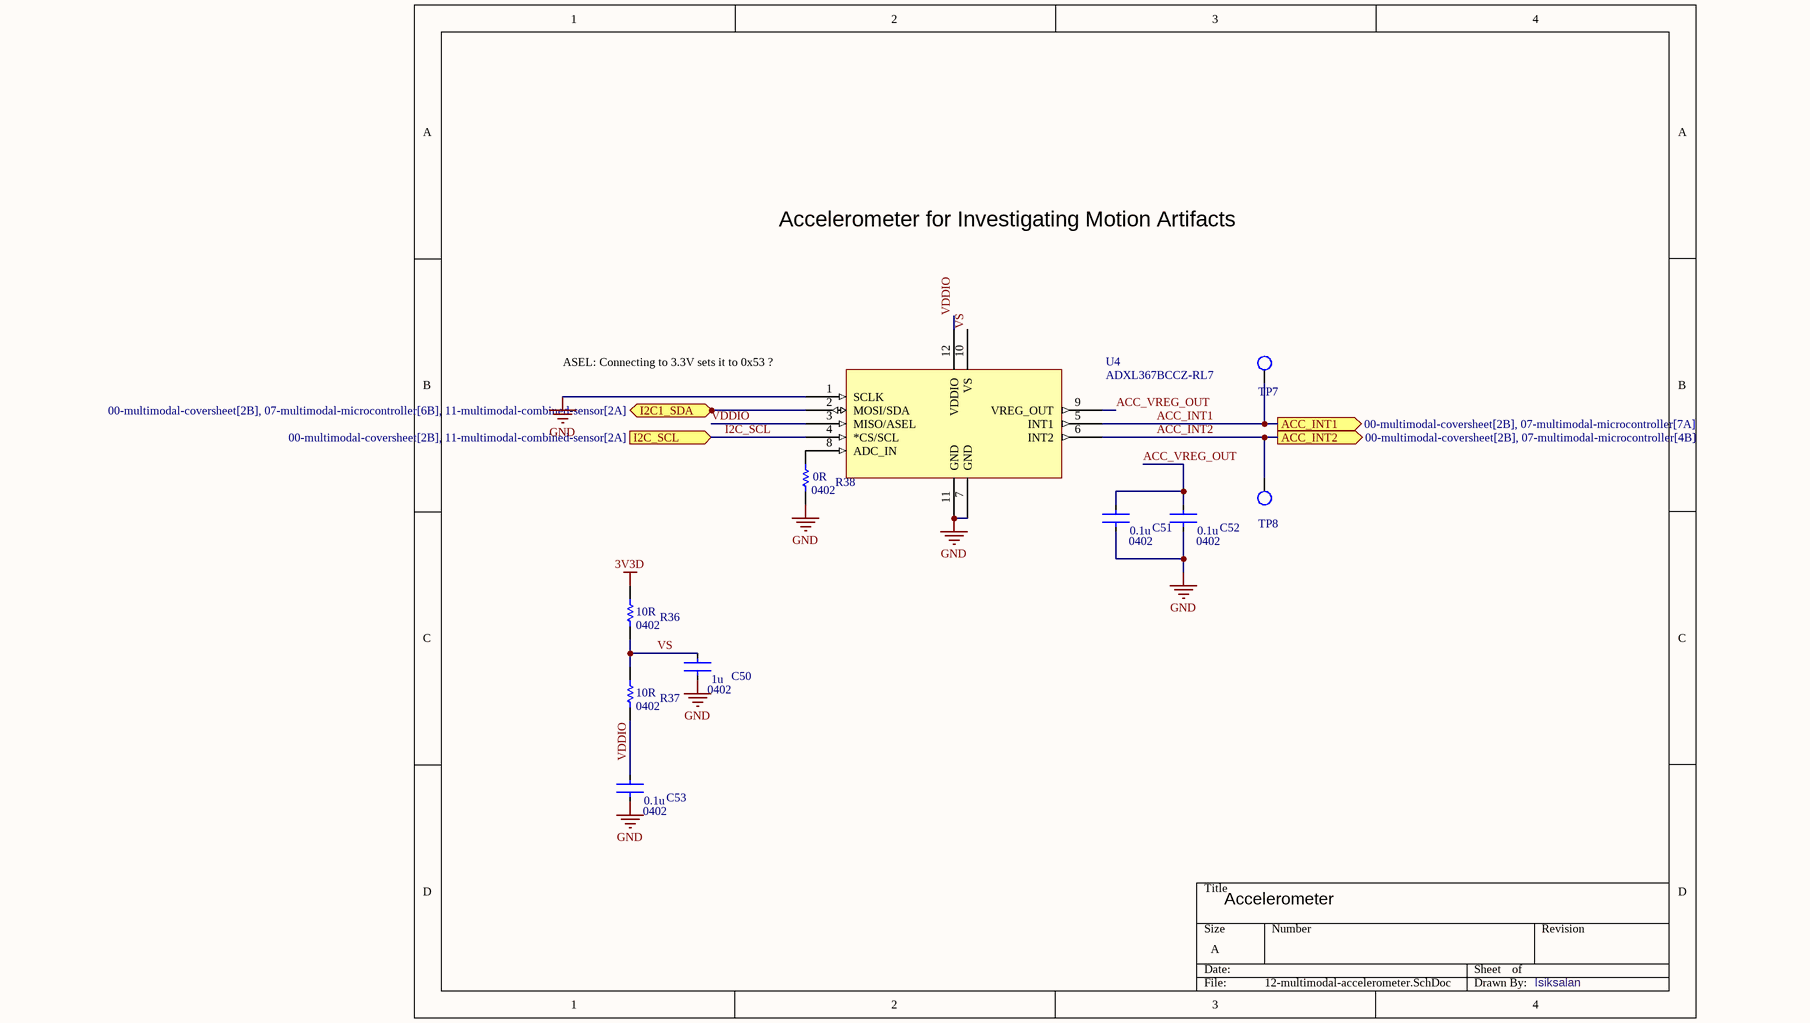
[diagram p5: 12-multimodal-accelerometer.SchDoc]

### Parts
C50  C1005X5R1V105K050BC  [CAPTDK0402]  (value not drawn)
C51  C1005X7R1H104K050BB  [CAPTDK0402]  (value not drawn)
C52  C1005X7R1H104K050BB  [CAPTDK0402]  (value not drawn)
C53  C1005X7R1H104K050BB  [CAPTDK0402]  (value not drawn)
R36  RMCF0402FT10R0  [RES-STACK-POLE-0402]  (value not drawn)
R37  RMCF0402FT10R0  [RES-STACK-POLE-0402]  (value not drawn)
R38  RMCF0402ZT0R00  [RES-STACK-POLE-0402]  (value not drawn)
TP7  TESTPOINT_S  [TESTPOINT_S]  (value not drawn)  (no BOM)
TP8  TESTPOINT_S  [TESTPOINT_S]  (value not drawn)  (no BOM)
U4  ADXL367BCCZ-RL7  [ADXL367BCCZ-RL7]

### Ports
ACC_INT1 (out, see 00-multimodal-coversheet[2B], 07-multimodal-microcontroller[7A]), ACC_INT2 (out, see 00-multimodal-coversheet[2B], 07-multimodal-microcontroller[4B]), I2C1_SDA (bidir, see 00-multimodal-coversheet[2B], 07-multimodal-microcontroller[6B], 11-multimodal-combined-sensor[2A]), I2C_SCL (in, see 00-multimodal-coversheet[2B], 11-multimodal-combined-sensor[2A])

### Nets
3V3D: R36.2
GND: C50.2 C51.2 C52.2 C53.2 R38.1 U4.1(SCLK) U4.7(GND) U4.11(GND)
ACC_INT1: TP7.1 U4.5(INT1) ; port ACC_INT1
ACC_INT2: TP8.1 U4.6(INT2) ; port ACC_INT2
ACC_VREG_OUT: C51.1 C52.1 U4.9(VREG_OUT)
I2C1_SDA: U4.2(MOSI/SDA) ; port I2C1_SDA
I2C_SCL: U4.4(*CS/SCL) ; port I2C_SCL  [project net I2C1_SCL]
VDDIO: C53.1 R37.1 U4.3(MISO/ASEL) U4.12(VDDIO)
VS: C50.1 R36.1 R37.2 U4.10(VS)
NetR38_2: R38.2 U4.8(ADC_IN)

### Notes on the sheet
- Accelerometer for Investigating Motion Artifacts
- (near U4) ASEL: Connecting to 3.3V sets it to 0x53 ?
- Accelerometer
- Isiksalan
- (in symbol C1005X5R1V105K050BC) 1u; 0402
- (in symbol C1005X7R1H104K050BB) 0.1u; 0402
- (in symbol RMCF0402FT10R0) 10R; 0402
- (in symbol RMCF0402ZT0R00) 0R; 0402

### Library data of the parts
C50 = C1005X5R1V105K050BC: CAP CER 1UF 35V X5R 0402; Supplier 1: Digi-Key; Supplier Part Number 1: 445-9073-1-ND
C51-C53 = C1005X7R1H104K050BB: CAP CER 0.1UF 50V X7R 0402; Supplier 1: Digi-Key; Supplier Part Number 1: 445-5932-1-ND
R36 R37 = RMCF0402FT10R0: RES 10 OHM 1% 1/16W 0402; Supplier 1: Digi-Key; Supplier Part Number 1: RMCF0402FT10R0CT-ND
R38 = RMCF0402ZT0R00: RES 0 OHM JUMPER 1/16W 0402; Supplier 1: Digi-Key; Supplier Part Number 1: RMCF0402ZT0R00CT-ND
TP7 TP8 = TESTPOINT_S: Testpoint Surface Pad
U4 = ADXL367BCCZ-RL7: Accelerometer X, Y, Z Axis ±2g, 4g, 8g 6.25Hz ~ 200Hz 12-LGA (2.2x2.3); Manufacturer_Name: Analog Devices Inc; Type: Motion Sensors; Copyright: Copyright (C) 2025 Ultra Librarian. All rights reserved.; Manufacturer_Part_Number: ADXL367BCCZ-RL7; RefDes: RefDes; Supplier 1: DigiKey; Supplier Part Number 1: 505-ADXL367BCCZ-RL7CT-ND

## Sheet 11-multimodal-combined-sensor.SchDoc
size A4; SheetNumber: 8; SheetTotal: 11
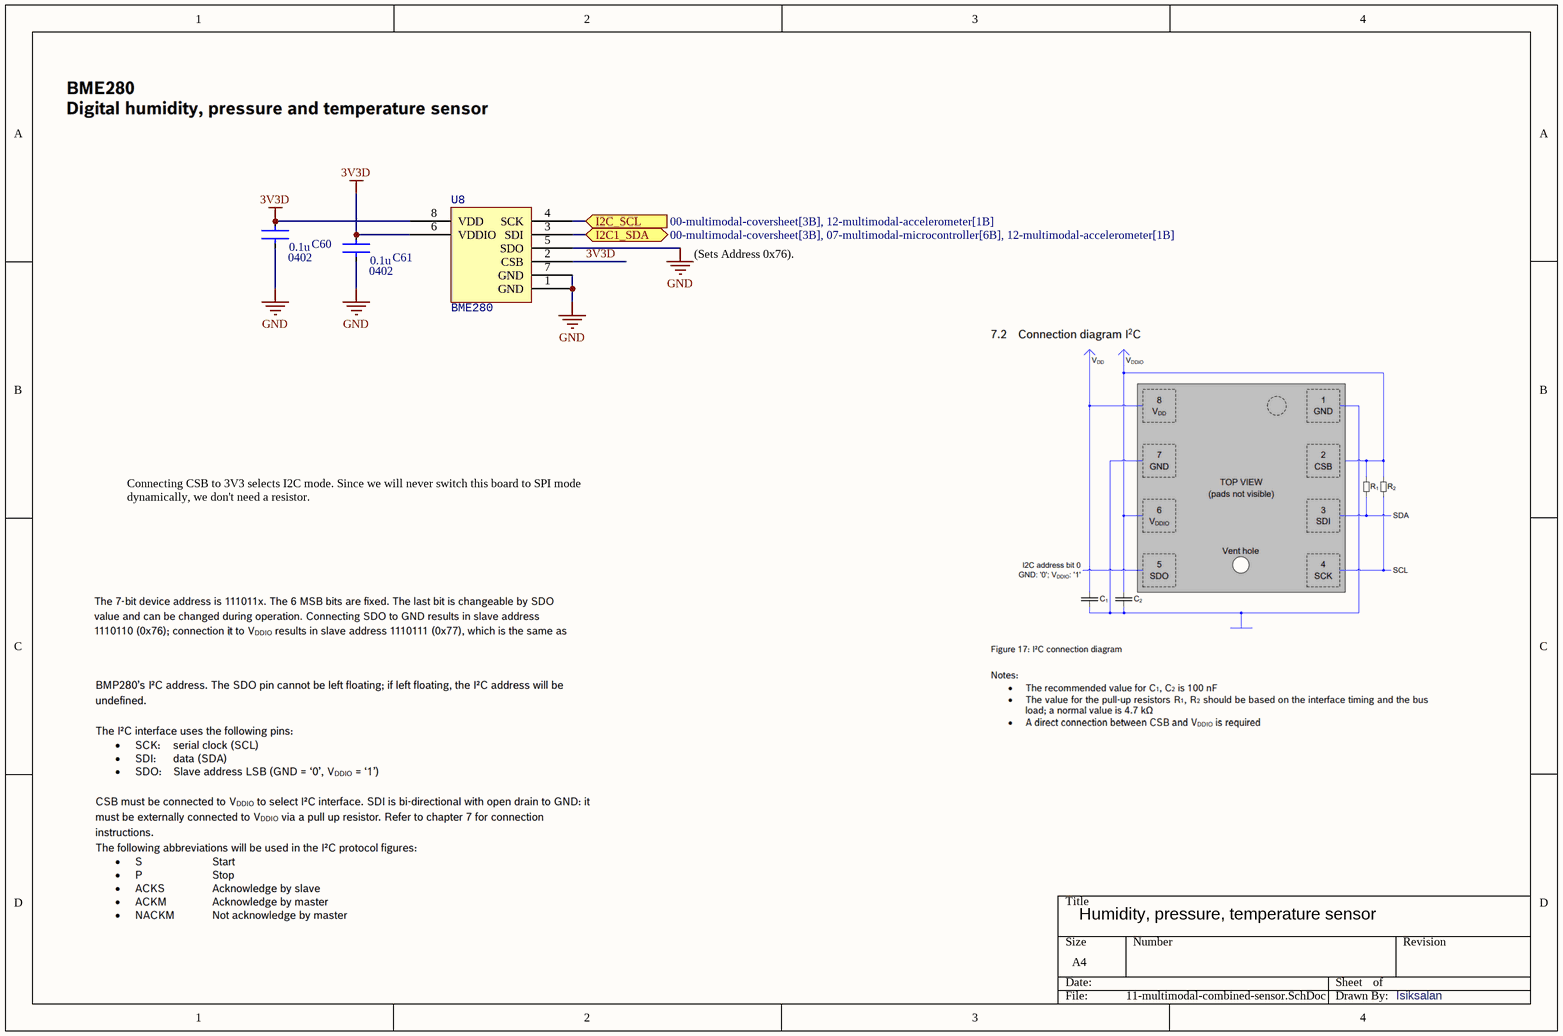
[diagram p6: 11-multimodal-combined-sensor.SchDoc]

### Parts
C60  C1005X7R1H104K050BB  [CAPTDK0402]  (value not drawn)
C61  C1005X7R1H104K050BB  [CAPTDK0402]  (value not drawn)
U8  BME280  [BME280_FOOTPRINT]

### Ports
I2C1_SDA (bidir, see 00-multimodal-coversheet[3B], 07-multimodal-microcontroller[6B], 12-multimodal-accelerometer[1B]), I2C_SCL (in, see 00-multimodal-coversheet[3B], 12-multimodal-accelerometer[1B])

### Nets
3V3D: C60.1 C61.1 U8.2(CSB) U8.6(VDDIO) U8.8(VDD)
GND: C60.2 C61.2 U8.1(GND) U8.5(SDO) U8.7(GND)
I2C1_SCL: U8.4(SCK) ; port I2C_SCL
I2C1_SDA: U8.3(SDI) ; port I2C1_SDA

### Notes on the sheet
- (Sets Address 0x76).
- Connecting CSB to 3V3 selects I2C mode. Since we will never switch this board to SPI mode dynamically, we don't need a resistor.
- Humidity, pressure, temperature sensor
- Isiksalan
- (in symbol C1005X7R1H104K050BB) 0.1u; 0402

### Library data of the parts
C60 C61 = C1005X7R1H104K050BB: CAP CER 0.1UF 50V X7R 0402; Supplier 1: Digi-Key; Supplier Part Number 1: 445-5932-1-ND
U8 = BME280: SENSOR PRESSURE HUMIDITY TEMP Humidity, Pressure, Temperature 0 ~ 100% RH I2C, SPI ±3% 1 s Surface Mount

## Sheet 04-multimodal-flash.SchDoc
size A4; SheetNumber: 2; SheetTotal: 11
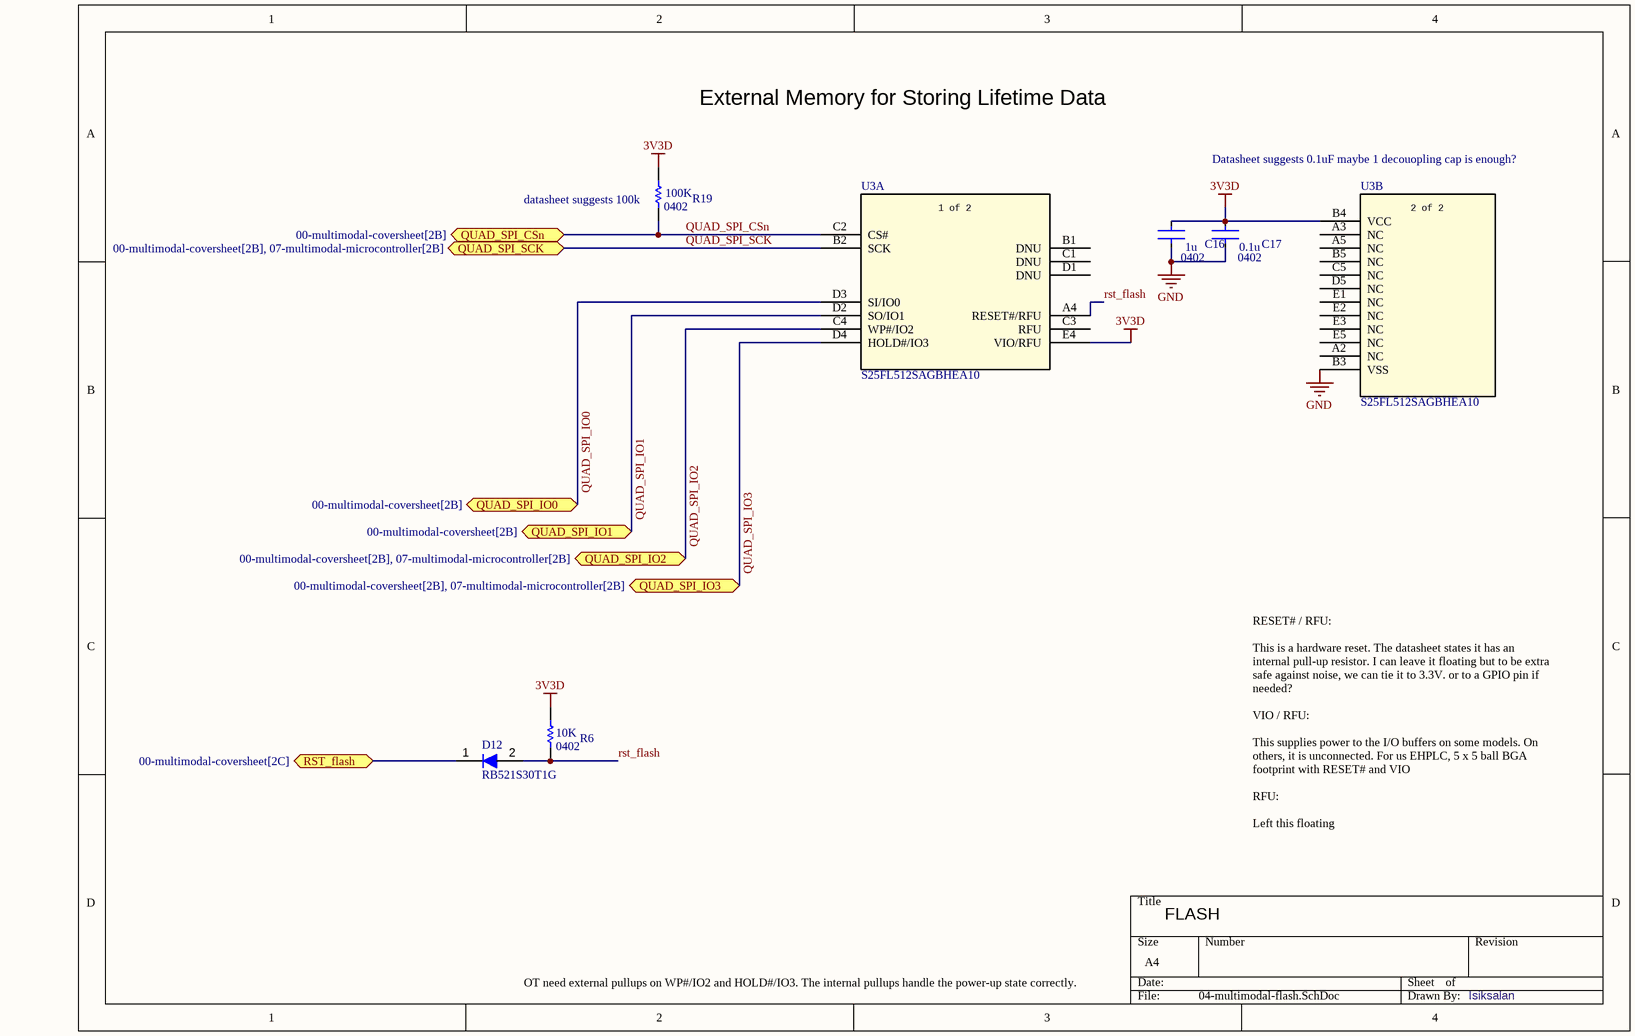
[diagram p7: 04-multimodal-flash.SchDoc]

### Parts
C16  C1005X5R1V105K050BC  [CAPTDK0402]  (value not drawn)
C17  C1005X7R1H104K050BB  [CAPTDK0402]  (value not drawn)
D12  RB521S30T1G  [SOD-523_0P9X1P3_ONS-L]
R6  RMCF0402FT10K0  [RES-STACK-POLE-0402]  (value not drawn)
R19  RMCF0402FT100K  [RES-STACK-POLE-0402]  (value not drawn)
U3  S25FL512SAGBHEA10  [BGA5x5_S25FL512SAGBHEA10_INF]  (parts A,B of 2)

### Ports
QUAD_SPI_CSn (bidir, see 00-multimodal-coversheet[2B]), QUAD_SPI_IO0 (bidir, see 00-multimodal-coversheet[2B]), QUAD_SPI_IO1 (bidir, see 00-multimodal-coversheet[2B]), QUAD_SPI_IO2 (bidir, see 00-multimodal-coversheet[2B], 07-multimodal-microcontroller[2B]), QUAD_SPI_IO3 (bidir, see 00-multimodal-coversheet[2B], 07-multimodal-microcontroller[2B]), QUAD_SPI_SCK (bidir, see 00-multimodal-coversheet[2B], 07-multimodal-microcontroller[2B]), RST_flash (bidir, see 00-multimodal-coversheet[2C])

### Nets
3V3D: C16.1 C17.1 R6.2 R19.2 U3.B4(VCC) U3.E4(VIO/RFU)
GND: C16.2 C17.2 U3.B3(VSS)
QUAD_SPI_CSn: R19.1 U3.C2(CS#) ; port QUAD_SPI_CSn
QUAD_SPI_IO0: U3.D3(SI/IO0) ; port QUAD_SPI_IO0
QUAD_SPI_IO1: U3.D2(SO/IO1) ; port QUAD_SPI_IO1
QUAD_SPI_IO2: U3.C4(WP#/IO2) ; port QUAD_SPI_IO2
QUAD_SPI_IO3: U3.D4(HOLD#/IO3) ; port QUAD_SPI_IO3
QUAD_SPI_SCK: U3.B2(SCK) ; port QUAD_SPI_SCK
rst_flash: D12.2 R6.1 U3.A4(RESET#/RFU)
RST_MCU: D12.1 ; port RST_flash

Not connected (* = marked no-connect by the designer): U3 A2(NC) A3(NC) A5(NC) B1(DNU) B5(NC) C1(DNU) C3(RFU) C5(NC) D1(DNU) D5(NC) E1(NC) E2(NC) E3(NC) E5(NC)

### Notes on the sheet
- External Memory for Storing Lifetime Data
- Datasheet suggests 0.1uF maybe 1 decouopling cap is enough?
- (near R19) datasheet suggests 100k
- RESET# / RFU:
  This is a hardware reset. The datasheet states it has an internal pull-up resistor. I can leave it floating but to be extra safe against noise, we can tie it to 3.3V. or to a GPIO pin if needed?
  VIO / RFU:
  This supplies power to the I/O buffers on some models. On others, it is unconnected. For us EHPLC, 5 x 5 ball BGA footprint with RESET# and VIO
  RFU:
  Left this floating
- FLASH
- OT need external pullups on WP#/IO2 and HOLD#/IO3. The internal pullups handle the power-up state correctly.
- Isiksalan
- (in symbol C1005X5R1V105K050BC) 1u; 0402
- (in symbol C1005X7R1H104K050BB) 0.1u; 0402
- (in symbol RMCF0402FT10K0) 10K; 0402
- (in symbol RMCF0402FT100K) 100K; 0402
- (in symbol S25FL512SAGBHEA10, part A) 1 of 2
- (in symbol S25FL512SAGBHEA10, part B) 2 of 2

### Library data of the parts
C16 = C1005X5R1V105K050BC: CAP CER 1UF 35V X5R 0402; Supplier 1: Digi-Key; Supplier Part Number 1: 445-9073-1-ND
C17 = C1005X7R1H104K050BB: CAP CER 0.1UF 50V X7R 0402; Supplier 1: Digi-Key; Supplier Part Number 1: 445-5932-1-ND
D12 = RB521S30T1G: DIODE SCHOTTKY 30V 200MA SOD523; Manufacturer: Hamamatsu; Manufacturer Part Number: S15193; ComponentLink1Description: Datasheet; ComponentLink1URL: https://www.hamamatsu.com/resources/pdf/ssd/s13773_kpin1088e.pdf; Supplier 1: Hamamatsu; Supplier 1 Part Number: S15193
R6 = RMCF0402FT10K0: RES 10K OHM 1% 1/16W 0402; Supplier 1: Digi-Key; Supplier Part Number 1: RMCF0402FT10K0CT-ND
R19 = RMCF0402FT100K: RES 100K OHM 1% 1/16W 0402; Supplier 1: Digi-Key; Supplier Part Number 1: RMCF0402FT100KCT-ND
U3 = S25FL512SAGBHEA10: FLASH - NOR Memory IC 512Mbit SPI - Quad I/O 133 MHz 24-BGA (6x8); Manufacturer_Name: Infineon; Type: Memory; Copyright: Copyright (C) 2025 Ultra Librarian. All rights reserved.; Manufacturer_Part_Number: S25FL512SAGBHEA10; RefDes: RefDes

## Sheet 01-multimodal-powersupply.SchDoc
size A4; SheetNumber: 11; SheetTotal: 11
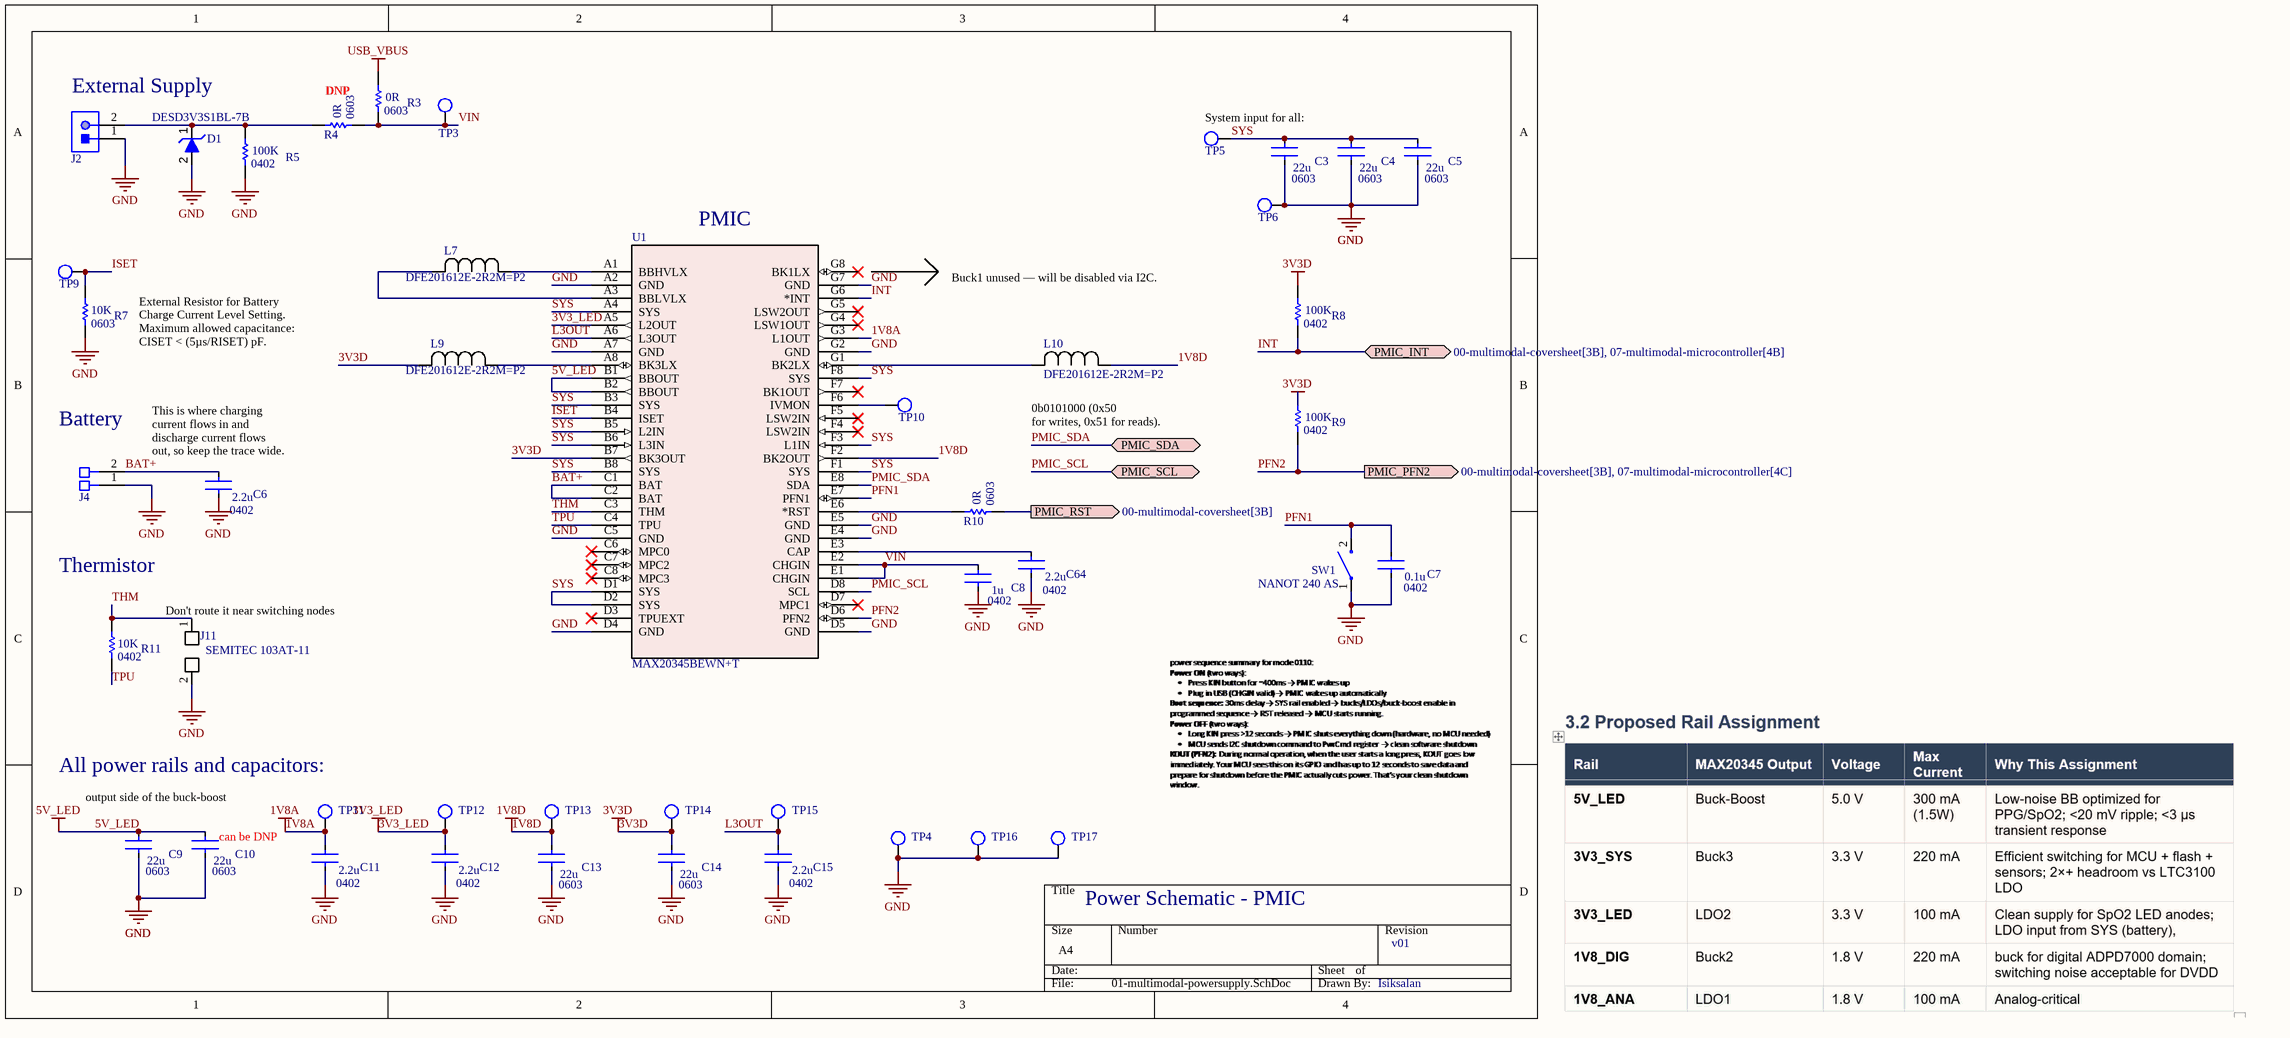
[diagram p8: 01-multimodal-powersupply.SchDoc]

### Parts
C3  GRM188R61A226ME15D  [CAPTDK0603]  (value not drawn)
C4  GRM188R61A226ME15D  [CAPTDK0603]  (value not drawn)
C5  GRM188R61A226ME15D  [CAPTDK0603]  (value not drawn)
C6  CL05A225KO5NQNC  [CAPTDK0402]  (value not drawn)
C7  C1005X7R1H104K050BB  [CAPTDK0402]  (value not drawn)
C8  C1005X5R1V105K050BC  [CAPTDK0402]  (value not drawn)
C9  GRM188R61A226ME15D  [CAPTDK0603]  (value not drawn)
C10  GRM188R61A226ME15D  [CAPTDK0603]  (value not drawn)
C11  CL05A225KO5NQNC  [CAPTDK0402]  (value not drawn)
C12  CL05A225KO5NQNC  [CAPTDK0402]  (value not drawn)
C13  GRM188R61A226ME15D  [CAPTDK0603]  (value not drawn)
C14  GRM188R61A226ME15D  [CAPTDK0603]  (value not drawn)
C15  CL05A225KO5NQNC  [CAPTDK0402]  (value not drawn)
C64  CL05A225KO5NQNC  [CAPTDK0402]  (value not drawn)
D1  DESD3V3S1BL-7B  [TVSDIODE-0402]
J2  TH-Connector  [2-PIN-TH-CONN]  (value not drawn)
J4  battery_connection  [Battery_connection]  (value not drawn)
J11  SEMITEC 103AT-11  [NTC_connection]
L7  DFE201612E-2R2M=P2  [IND_DFE2016_MUR-L]
L9  DFE201612E-2R2M=P2  [IND_DFE2016_MUR-L]
L10  DFE201612E-2R2M=P2  [IND_DFE2016_MUR-L]
R3  RMCF0603ZT0R00  [RES-STACK-POLE-0603]  (value not drawn)
R4  RMCF0603ZT0R00  [RES-STACK-POLE-0603]  (value not drawn)  (no BOM)
R5  RMCF0402FT100K  [RES-STACK-POLE-0402]  (value not drawn)
R7  RMCF0603JG10K0  [RES-STACK-POLE-0603]  (value not drawn)
R8  RMCF0402FT100K  [RES-STACK-POLE-0402]  (value not drawn)
R9  RMCF0402FT100K  [RES-STACK-POLE-0402]  (value not drawn)
R10  RMCF0603ZT0R00  [RES-STACK-POLE-0603]  (value not drawn)
R11  RMCF0402FT10K0  [RES-STACK-POLE-0402]  (value not drawn)
SW1  NANOT 240 AS  [TACTILE-SWITCH - TINY]
TP3  TESTPOINT_S  [TESTPOINT_S]  (value not drawn)  (no BOM)
TP4  TESTPOINT_S  [TESTPOINT_S]  (value not drawn)  (no BOM)
TP5  TESTPOINT_S  [TESTPOINT_S]  (value not drawn)  (no BOM)
TP6  TESTPOINT_S  [TESTPOINT_S]  (value not drawn)  (no BOM)
TP9  TESTPOINT_S  [TESTPOINT_S]  (value not drawn)  (no BOM)
TP10  TESTPOINT_S  [TESTPOINT_S]  (value not drawn)  (no BOM)
TP11  TESTPOINT_S  [TESTPOINT_S]  (value not drawn)  (no BOM)
TP12  TESTPOINT_S  [TESTPOINT_S]  (value not drawn)  (no BOM)
TP13  TESTPOINT_S  [TESTPOINT_S]  (value not drawn)  (no BOM)
TP14  TESTPOINT_S  [TESTPOINT_S]  (value not drawn)  (no BOM)
TP15  TESTPOINT_S  [TESTPOINT_S]  (value not drawn)  (no BOM)
TP16  TESTPOINT_S  [TESTPOINT_S]  (value not drawn)  (no BOM)
TP17  TESTPOINT_S  [TESTPOINT_S]  (value not drawn)  (no BOM)
U1  MAX20345BEWN+T  [21-100260_W563H3+1_ADI]

### Ports
PMIC_INT (bidir, see 00-multimodal-coversheet[3B], 07-multimodal-microcontroller[4B]), PMIC_PFN2 (out, see 00-multimodal-coversheet[3B], 07-multimodal-microcontroller[4C]), PMIC_RST (out, see 00-multimodal-coversheet[3B]), PMIC_SCL (bidir, see 00-multimodal-coversheet[3B]), PMIC_SDA (bidir, see 00-multimodal-coversheet[3B])

### Nets
1V8A: C11.1 TP11.1 U1.G3(L1OUT)
1V8D: C13.1 L10.1 TP13.1 U1.F2(BK2OUT)
3V3_LED: C12.1 TP12.1 U1.A5(L2OUT)
3V3D: C14.1 L9.2 R8.2 R9.2 TP14.1 U1.B7(BK3OUT)
5V_LED: C9.1 C10.1 U1.B1(BBOUT) U1.B2(BBOUT)
GND: C3.2 C4.2 C5.2 C6.2 C7.2 C8.2 C9.2 C10.2 C11.2 C12.2 C13.2 C14.2 C15.2 C64.2 D1.2 J2.1 J4.1 J11.2 R5.1 R7.1 SW1.1 TP4.1 TP6.1 TP16.1 TP17.1 U1.A2(GND) U1.A7(GND) U1.C5(GND) U1.D4(GND) U1.D5(GND) U1.E4(GND) U1.E5(GND) U1.G2(GND) U1.G7(GND)
USB_VBUS: R3.2
BAT+: C6.1 J4.2 U1.C1(BAT) U1.C2(BAT)
INT: R8.1 U1.G6(*INT) ; port PMIC_INT
ISET: R7.2 TP9.1 U1.B4(ISET)
L3OUT: C15.1 TP15.1 U1.A6(L3OUT)
PFN1: C7.1 SW1.2 U1.E7(PFN1)
PFN2: R9.1 U1.D6(PFN2) ; port PMIC_PFN2
PMIC_SCL: U1.D8(SCL) ; port PMIC_SCL  [project net I2C1_SCL]
PMIC_SDA: U1.E8(SDA) ; port PMIC_SDA  [project net I2C1_SDA]
RST_MCU: R10.1 ; port PMIC_RST
SYS: C3.1 C4.1 C5.1 TP5.1 U1.A4(SYS) U1.B3(SYS) U1.B5(L2IN) U1.B6(L3IN) U1.B8(SYS) U1.D1(SYS) U1.D2(SYS) U1.F1(SYS) U1.F3(L1IN) U1.F8(SYS)
THM: J11.1 R11.2 U1.C3(THM)
TPU: R11.1 U1.C4(TPU)
VIN: C8.1 R3.1 R4.1 TP3.1 U1.E1(CHGIN) U1.E2(CHGIN)
NetC64_1: C64.1 U1.E3(CAP)
NetD1_1: D1.1 J2.2 R4.2 R5.2
NetL7_1: L7.1 U1.A1(BBHVLX)
NetL7_2: L7.2 U1.A3(BBLVLX)
NetL9_1: L9.1 U1.A8(BK3LX)
NetL10_2: L10.2 U1.G1(BK2LX)
NetR10_2: R10.2 U1.E6(*RST)
NetTP10_1: TP10.1 U1.F6(IVMON)

Not connected (* = marked no-connect by the designer): U1 C6(MPC0)* C7(MPC2)* C8(MPC3)* D3(TPUEXT)* D7(MPC1)* F4(LSW2IN)* F5(LSW2IN)* F7(BK1OUT)* G4(LSW1OUT)* G5(LSW2OUT)* G8(BK1LX)*

### Notes on the sheet
- External Supply
- DNP
- System input for all:
- (near U1) PMIC
- Buck1 unused — will be disabled via I2C.
- External Resistor for Battery Charge Current Level Setting.
  Maximum allowed capacitance: CISET < (5µs/RISET) pF.
- (near J4) Battery
- (near L10) 0b0101000 (0x50
  for writes, 0x51 for reads).
- (near C6) This is where charging current flows in and discharge current flows out, so keep the trace wide.
- Thermistor
- (near J11) Don't route it near switching nodes
- All power rails and capacitors:
- output side of the buck-boost
- (near C10) can be DNP
- (near TP17) Power Schematic - PMIC
- v01
- Isiksalan
- (in symbol C1005X5R1V105K050BC) 1u; 0402
- (in symbol C1005X7R1H104K050BB) 0.1u; 0402
- (in symbol CL05A225KO5NQNC) 2.2u; 0402
- (in symbol GRM188R61A226ME15D) 22u; 0603
- (in symbol RMCF0402FT10K0) 10K; 0402
- (in symbol RMCF0402FT100K) 100K; 0402
- (in symbol RMCF0603JG10K0) 10K; 0603
- (in symbol RMCF0603ZT0R00) 0R; 0603

### Library data of the parts
C3-C5 C9 C10 C13 C14 = GRM188R61A226ME15D: CAP CER 22UF 10V X5R 0603; Supplier 1: Avnet; Supplier Part Number 1: GRM188R61A226ME15D
C6 C11 C12 C15 C64 = CL05A225KO5NQNC: CAP CER 2.2UF 16V X5R 0402; Supplier 1: Avnet; Supplier Part Number 1: CL05A225KO5NQNC
C7 = C1005X7R1H104K050BB: CAP CER 0.1UF 50V X7R 0402; Supplier 1: Digi-Key; Supplier Part Number 1: 445-5932-1-ND
C8 = C1005X5R1V105K050BC: CAP CER 1UF 35V X5R 0402; Supplier 1: Digi-Key; Supplier Part Number 1: 445-9073-1-ND
D1 = DESD3V3S1BL-7B: TVS DIODE 3.3V 7V DFN1006-2; Manufacturer: Diodes; Direction: Bidirectional; Number of Bidirectional Channels: 1; Min Breakdown Voltage: 3.8V; Peak Pulse Power: 35W; Power Line Protection: No; Max Reverse Leakage Current: 100nA; Element Configuration: Single; Breakdown Voltage: 6.5V; Peak Pulse Current: 5A; Supplier 1: Digi-Key; Manufacturer Part Number: DESD3V3S1BL-7B; RoHS: Yes; Category: TVS Diodes; Stock 1: 514017; Pricing 1: 1=0.32000, 10=0.26000, 100=0.13790, 500=0.09076, 1000=0.06171, 2000=0.05566, 5000=0.04840 (USD); Mount: Surface Mount; Number of Pins: 2; Min Operating Temperature: -65°C; Max Operating Temperature: 150°C; Packaging: Tape and Reel; Package Quantity: 10000; Reverse Standoff Voltage: 3.3V; Clamping Voltage: 7V; Polarity: Bidirectional; Termination: SMD/SMT; Working Voltage: 3.3V; Max Power Dissipation: 35W; Resistor Type: Zener; Radiation Hardening: No; RoHS Compliant: Yes; ComponentLink1URL: https://www.diodes.com/assets/Datasheets/DESD3V3S1BL.pdf; ComponentLink1Description: Datasheet; Supplier Part Number 1: DESD3V3S1BL-7BDICT-ND; ComponentLink2Description: New link; ComponentLink2URL: *
J2 = TH-Connector: Power Connector
J11 = SEMITEC 103AT-11: NTC THERMISTOR 10KOHM 1%
L7 L9 L10 = DFE201612E-2R2M=P2: 2.2 µH Shielded Drum Core, Wirewound Inductor 1.8 A 116mOhm Max 0806 (2016 Metric); Manufacturer_Name: Murata; Type: Fixed Inductors; Copyright: Copyright (C) 2025 Ultra Librarian. All rights reserved.; Manufacturer_Part_Number: DFE201612E-2R2M=P2
R3 R4 R10 = RMCF0603ZT0R00: RES 0 OHM JUMPER 1/10W 0603; Supplier 1: Digi-Key; Supplier Part Number 1: RMCF0603ZT0R00CT-ND
R5 R8 R9 = RMCF0402FT100K: RES 100K OHM 1% 1/16W 0402; Supplier 1: Digi-Key; Supplier Part Number 1: RMCF0402FT100KCT-ND
R7 = RMCF0603JG10K0: RES 10K OHM 5% 1/10W 0603; Supplier 1: Digi-Key; Supplier Part Number 1: 738-RMCF0603JG10K0CT-ND
R11 = RMCF0402FT10K0: RES 10K OHM 1% 1/16W 0402; Supplier 1: Digi-Key; Supplier Part Number 1: RMCF0402FT10K0CT-ND
SW1 = NANOT 240 AS: SWITCH TACTILE SPST-NO 0.02A 15V; Supplier 1: Future Electronics; Supplier Part Number 1: 2189518
TP3-TP6 TP9-TP17 = TESTPOINT_S: Testpoint Surface Pad
U1 = MAX20345BEWN+T: PMIC with Ultra-Low IQ Voltage Regulators, Buck-Boost for Optical Sensing and Charger for Small Lithium Ion Systems; Manufacturer_Name: Analog Devices Inc; Manufacturer_Part_Number: MAX20345KEWN+T; Copyright: Copyright (C) 2026 Ultra Librarian. All rights reserved.; RefDes: RefDes; Type: Type; Supplier 1: DigiKey; Supplier Part Number 1: 505-MAX20345BEWN+TTR-ND

## Sheet 07-multimodal-microcontroller.SchDoc
size A3; SheetNumber: 5; SheetTotal: 11
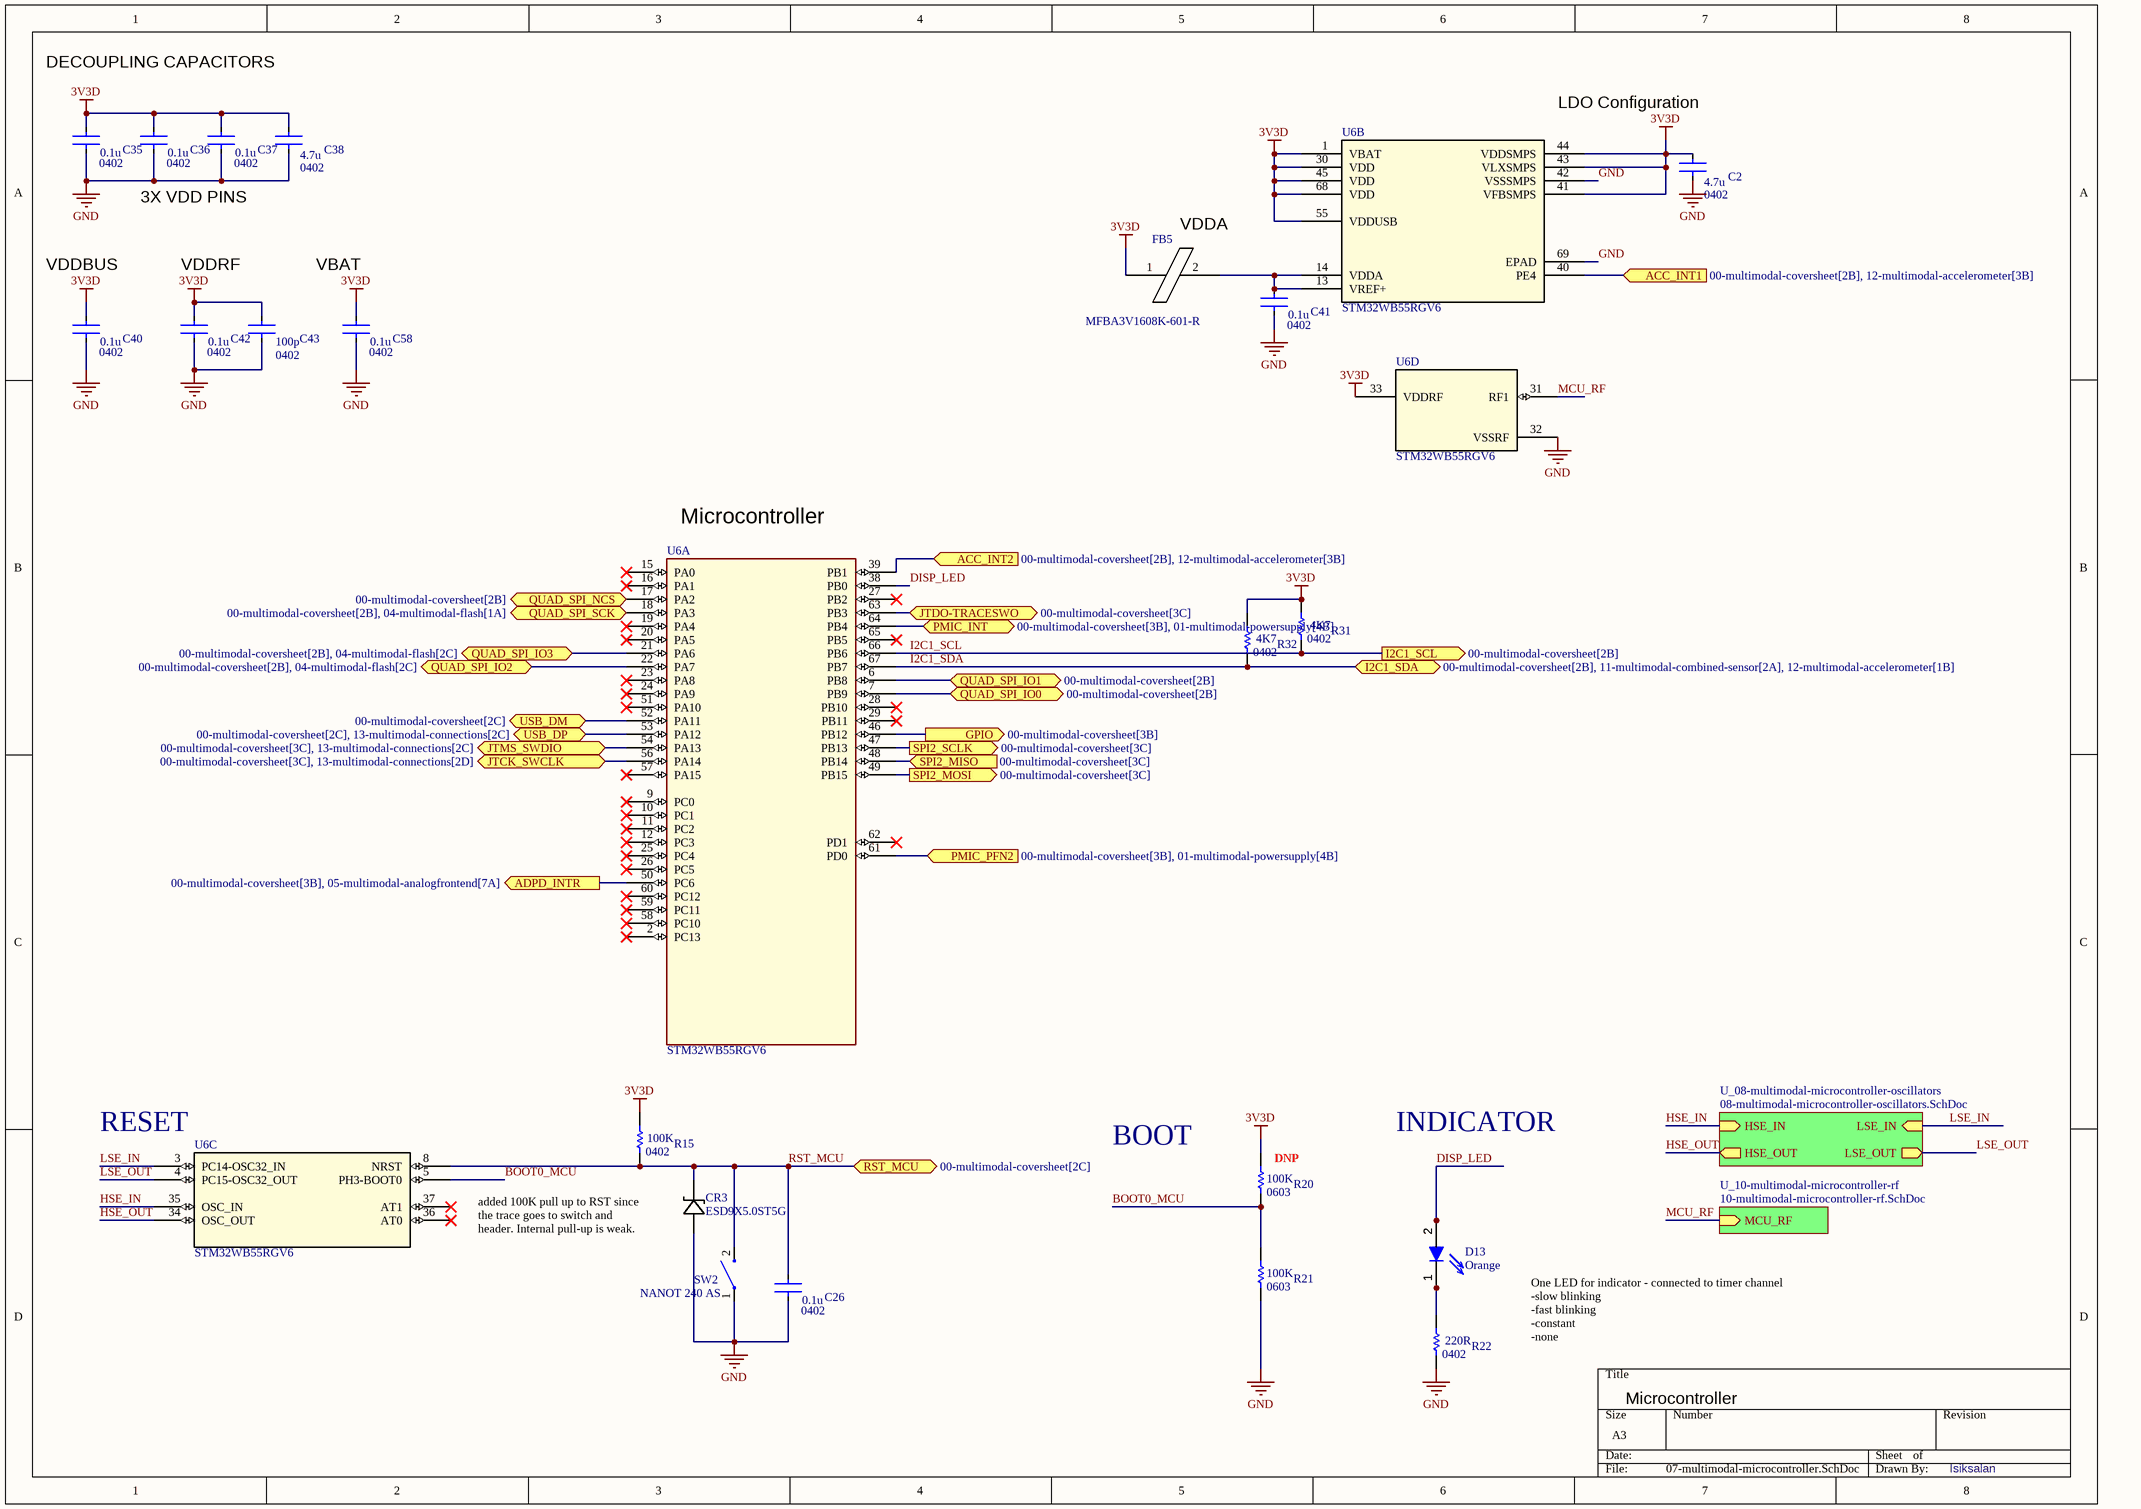
[diagram p9: 07-multimodal-microcontroller.SchDoc]

### Parts
C2  C1005X5R1A475K050BC  [CAPTDK0402]  (value not drawn)
C26  C1005X7R1H104K050BB  [CAPTDK0402]  (value not drawn)
C35  C1005X7R1H104K050BB  [CAPTDK0402]  (value not drawn)
C36  C1005X7R1H104K050BB  [CAPTDK0402]  (value not drawn)
C37  C1005X7R1H104K050BB  [CAPTDK0402]  (value not drawn)
C38  C1005X5R1A475K050BC  [CAPTDK0402]  (value not drawn)
C40  C1005X7R1H104K050BB  [CAPTDK0402]  (value not drawn)
C41  C1005X7R1H104K050BB  [CAPTDK0402]  (value not drawn)
C42  C1005X7R1H104K050BB  [CAPTDK0402]  (value not drawn)
C43  CGA2B2C0G1H101J050BA  [CAPTDK0402]  (value not drawn)
C58  C1005X7R1H104K050BB  [CAPTDK0402]  (value not drawn)
CR3  ESD9X5.0ST5G  [SOD-923_514AB_ONS]
D13  Orange  [DISPLAY-LED]
FB5  MFBA3V1608K-601-R  [INDMURT0603]
R15  RMCF0402FT100K  [RES-STACK-POLE-0402]  (value not drawn)
R20  RMCF0603JG100K  [RES-STACK-POLE-0603]  (value not drawn)  (no BOM)
R21  RMCF0603JG100K  [RES-STACK-POLE-0603]  (value not drawn)
R22  RMCF0402JT220R  [RES-STACK-POLE-0402]  (value not drawn)
R31  RMCF0402FT4K70  [RES-STACK-POLE-0402]  (value not drawn)
R32  RMCF0402FT4K70  [RES-STACK-POLE-0402]  (value not drawn)
SW2  NANOT 240 AS  [TACTILE-SWITCH - TINY]
U6  STM32WB55RGV6  [STM32WB55RG]  (parts A,B,C,D of 4)

### Sub-sheets
U_08-multimodal-microcontroller-oscillators = 08-multimodal-microcontroller-oscillators.SchDoc: LSE_IN (in), LSE_OUT (out), HSE_IN (in), HSE_OUT (out)
U_10-multimodal-microcontroller-rf = 10-multimodal-microcontroller-rf.SchDoc: MCU_RF (in)

### Ports
ACC_INT1 (in, see 00-multimodal-coversheet[2B], 12-multimodal-accelerometer[3B]), ACC_INT2 (in, see 00-multimodal-coversheet[2B], 12-multimodal-accelerometer[3B]), ADPD_INTR (out, see 00-multimodal-coversheet[3B], 05-multimodal-analogfrontend[7A]), GPIO (out, see 00-multimodal-coversheet[3B]), I2C1_SCL (out, see 00-multimodal-coversheet[2B]), I2C1_SDA (bidir, see 00-multimodal-coversheet[2B], 11-multimodal-combined-sensor[2A], 12-multimodal-accelerometer[1B]), JTCK_SWCLK (bidir, see 00-multimodal-coversheet[3C], 13-multimodal-connections[2D]), JTDO-TRACESWO (bidir, see 00-multimodal-coversheet[3C]), JTMS_SWDIO (bidir, see 00-multimodal-coversheet[3C], 13-multimodal-connections[2C]), PMIC_INT (bidir, see 00-multimodal-coversheet[3B], 01-multimodal-powersupply[4B]), PMIC_PFN2 (in, see 00-multimodal-coversheet[3B], 01-multimodal-powersupply[4B]), QUAD_SPI_IO0 (bidir, see 00-multimodal-coversheet[2B]), QUAD_SPI_IO1 (bidir, see 00-multimodal-coversheet[2B]), QUAD_SPI_IO2 (bidir, see 00-multimodal-coversheet[2B], 04-multimodal-flash[2C]), QUAD_SPI_IO3 (bidir, see 00-multimodal-coversheet[2B], 04-multimodal-flash[2C]), QUAD_SPI_NCS (bidir, see 00-multimodal-coversheet[2B]), QUAD_SPI_SCK (bidir, see 00-multimodal-coversheet[2B], 04-multimodal-flash[1A]), RST_MCU (bidir, see 00-multimodal-coversheet[2C]), SPI2_MISO (in, see 00-multimodal-coversheet[3C]), SPI2_MOSI (out, see 00-multimodal-coversheet[3C]), SPI2_SCLK (out, see 00-multimodal-coversheet[3C]), USB_DM (bidir, see 00-multimodal-coversheet[2C]), USB_DP (bidir, see 00-multimodal-coversheet[2C], 13-multimodal-connections[2C])

### Nets
3V3D: C2.1 C35.1 C36.1 C37.1 C38.1 C40.1 C42.1 C43.1 C58.1 FB5.1 R15.2 R20.2 R31.2 R32.2 U6.1(VBAT) U6.30(VDD) U6.33(VDDRF) U6.41(VFBSMPS) U6.43(VLXSMPS) U6.44(VDDSMPS) U6.45(VDD) U6.55(VDDUSB) U6.68(VDD)
GND: C2.2 C26.2 C35.2 C36.2 C37.2 C38.2 C40.2 C41.2 C42.2 C43.2 C58.2 CR3.2 R21.1 R22.1 SW2.1 U6.32(VSSRF) U6.42(VSSSMPS) U6.69(EPAD)
ACC_INT1: U6.40(PE4) ; port ACC_INT1
ACC_INT2: U6.39(PB1) ; port ACC_INT2
ADPD_INTR: U6.50(PC6) ; port ADPD_INTR
BOOT0_MCU: R20.1 R21.2 U6.5(PH3-BOOT0)
DISP_LED: D13.2 U6.38(PB0)
HSE_IN: U6.35(OSC_IN) ; sheet U_08-multimodal-microcontroller-oscillators/HSE_IN
HSE_OUT: U6.34(OSC_OUT) ; sheet U_08-multimodal-microcontroller-oscillators/HSE_OUT
I2C1_SCL: R31.1 U6.66(PB6) ; port I2C1_SCL
I2C1_SDA: R32.1 U6.67(PB7) ; port I2C1_SDA
INT: U6.64(PB4) ; port PMIC_INT
LSE_IN: U6.3(PC14-OSC32_IN) ; sheet U_08-multimodal-microcontroller-oscillators/LSE_IN
LSE_OUT: U6.4(PC15-OSC32_OUT) ; sheet U_08-multimodal-microcontroller-oscillators/LSE_OUT
MCU_RF: U6.31(RF1) ; sheet U_10-multimodal-microcontroller-rf/MCU_RF
PFN2: U6.61(PD0) ; port PMIC_PFN2
QUAD_SPI_CSn: U6.17(PA2) ; port QUAD_SPI_NCS
QUAD_SPI_IO0: U6.6(PB8) ; port QUAD_SPI_IO1
QUAD_SPI_IO1: U6.7(PB9) ; port QUAD_SPI_IO0
QUAD_SPI_IO2: U6.22(PA7) ; port QUAD_SPI_IO2
QUAD_SPI_IO3: U6.21(PA6) ; port QUAD_SPI_IO3
QUAD_SPI_SCK: U6.18(PA3) ; port QUAD_SPI_SCK
RST_MCU: C26.1 CR3.1 R15.1 SW2.2 U6.8(NRST) ; port RST_MCU
NetC41_1: C41.1 FB5.2 U6.13(VREF+) U6.14(VDDA)
NetCR1_1: U6.53(PA12) ; port USB_DP
NetCR1_3: U6.52(PA11) ; port USB_DM
NetD13_1: D13.1 R22.2
NetJ1_02: U6.54(PA13) ; port JTMS_SWDIO
NetJ1_04: U6.56(PA14) ; port JTCK_SWCLK
NetJ1_06: U6.63(PB3) ; port JTDO-TRACESWO
NetR24_1: U6.46(PB12) ; port GPIO
NetU5_A1: U6.47(PB13) ; port SPI2_SCLK
NetU5_B1: U6.48(PB14) ; port SPI2_MISO
NetU5_B2: U6.49(PB15) ; port SPI2_MOSI

Not connected (* = marked no-connect by the designer): U6 2(PC13)* 9(PC0)* 10(PC1)* 11(PC2)* 12(PC3)* 15(PA0)* 16(PA1)* 19(PA4)* 20(PA5)* 23(PA8)* 24(PA9)* 25(PC4)* 26(PC5)* 27(PB2)* 28(PB10)* 29(PB11)* 36(AT0)* 37(AT1)* 51(PA10)* 57(PA15)* 58(PC10)* 59(PC11)* 60(PC12)* 62(PD1)* 65(PB5)*

### Notes on the sheet
- DECOUPLING CAPACITORS
- LDO Configuration
- 3X VDD PINS
- (near FB5) VDDA
- (near C40) VDDBUS
- VDDRF
- VBAT
- (near U6) Microcontroller
- (near U6) RESET
- BOOT
- (near R20) DNP
- INDICATOR
- added 100K pull up to RST since the trace goes to switch and header. Internal pull-up is weak.
- One LED for indicator - connected to timer channel
  -slow blinking
  -fast blinking
  -constant
  -none
- Microcontroller
- Isiksalan
- (in symbol C1005X5R1A475K050BC) 4.7u; 0402
- (in symbol C1005X7R1H104K050BB) 0.1u; 0402
- (in symbol CGA2B2C0G1H101J050BA_1) 100p; 0402
- (in symbol RMCF0402FT4K70) 4K7; 0402
- (in symbol RMCF0402FT100K) 100K; 0402
- (in symbol RMCF0402JT220R) 220R; 0402
- (in symbol RMCF0603JG100K) 100K; 0603

### Library data of the parts
C2 C38 = C1005X5R1A475K050BC: CAP CER 4.7UF 10V X5R 0402; Supplier 1: Digi-Key; Supplier Part Number 1: 445-13820-1-ND
C26 C35-C37 C40-C42 C58 = C1005X7R1H104K050BB: CAP CER 0.1UF 50V X7R 0402; Supplier 1: Digi-Key; Supplier Part Number 1: 445-5932-1-ND
C43 = CGA2B2C0G1H101J050BA_1: CAP CER 100PF 50V C0G 0402; Supplier 1: Digi-Key; Supplier Part Number 1: 445-5596-1-ND
CR3 = ESD9X5.0ST5G: TVS DIODE 5VWM 12.3VC SOD923; Manufacturer_Name: onsemi; Copyright: Copyright (C) 2026 Ultra Librarian. All rights reserved.; Manufacturer_Part_Number: ESD9X5.0ST5G; Supplier 1: Avnet; Supplier Part Number 1: ESD9X5.0ST5G
D13 = LTST-C191KFKT: LED ORANGE CLEAR 0603 SMD; Supplier 1: Digi-Key; Supplier Part Number 1: 160-1445-1-ND
FB5 = MFBA3V1608K-601-R: FERRITE BEAD 600 OHM 0603 1LN; Supplier 1: DigiKey; Supplier Part Number 1: 283-MFBA3V1608K-601-RCT-ND
R15 = RMCF0402FT100K: RES 100K OHM 1% 1/16W 0402; Supplier 1: Digi-Key; Supplier Part Number 1: RMCF0402FT100KCT-ND
R20 R21 = RMCF0603JG100K: RES 100K OHM 5% 1/10W 0603; Supplier 1: DigiKey; Supplier Part Number 1: RMCF0603JG100KCT-ND
R22 = RMCF0402JT220R: RES 220 OHM 5% 1/16W 0402; Supplier 1: Digi-Key; Supplier Part Number 1: RMCF0402JT220RCT-ND
R31 R32 = RMCF0402FT4K70: RES 4.7K OHM 1% 1/16W 0402; Supplier 1: Digi-Key; Supplier Part Number 1: RMCF0402FT4K70CT-ND
SW2 = NANOT 240 AS: SWITCH TACTILE SPST-NO 0.02A 15V; Supplier 1: Future Electronics; Supplier Part Number 1: 2189518
U6 = STM32WB55RGV6: Ultra-low-power dual core Arm Cortex-M4 MCU 64 MHz, Cortex-M0+ 32 MHz with 1 Mbyte of Flash memory, Bluetooth LE 5.4, 802.15.4, Zigbee, Thread, Matter, USB, LCD, AES-256; Manufacturer_Name: STMicroelectronics; Copyright: Copyright (C) 2025 Ultra Librarian. All rights reserved.; Manufacturer_Part_Number: STM32WB55RGV6; RefDes: RefDes; Type: Type

## Sheet 08-multimodal-microcontroller-oscillators.SchDoc
size A; SheetNumber: 6; SheetTotal: 11
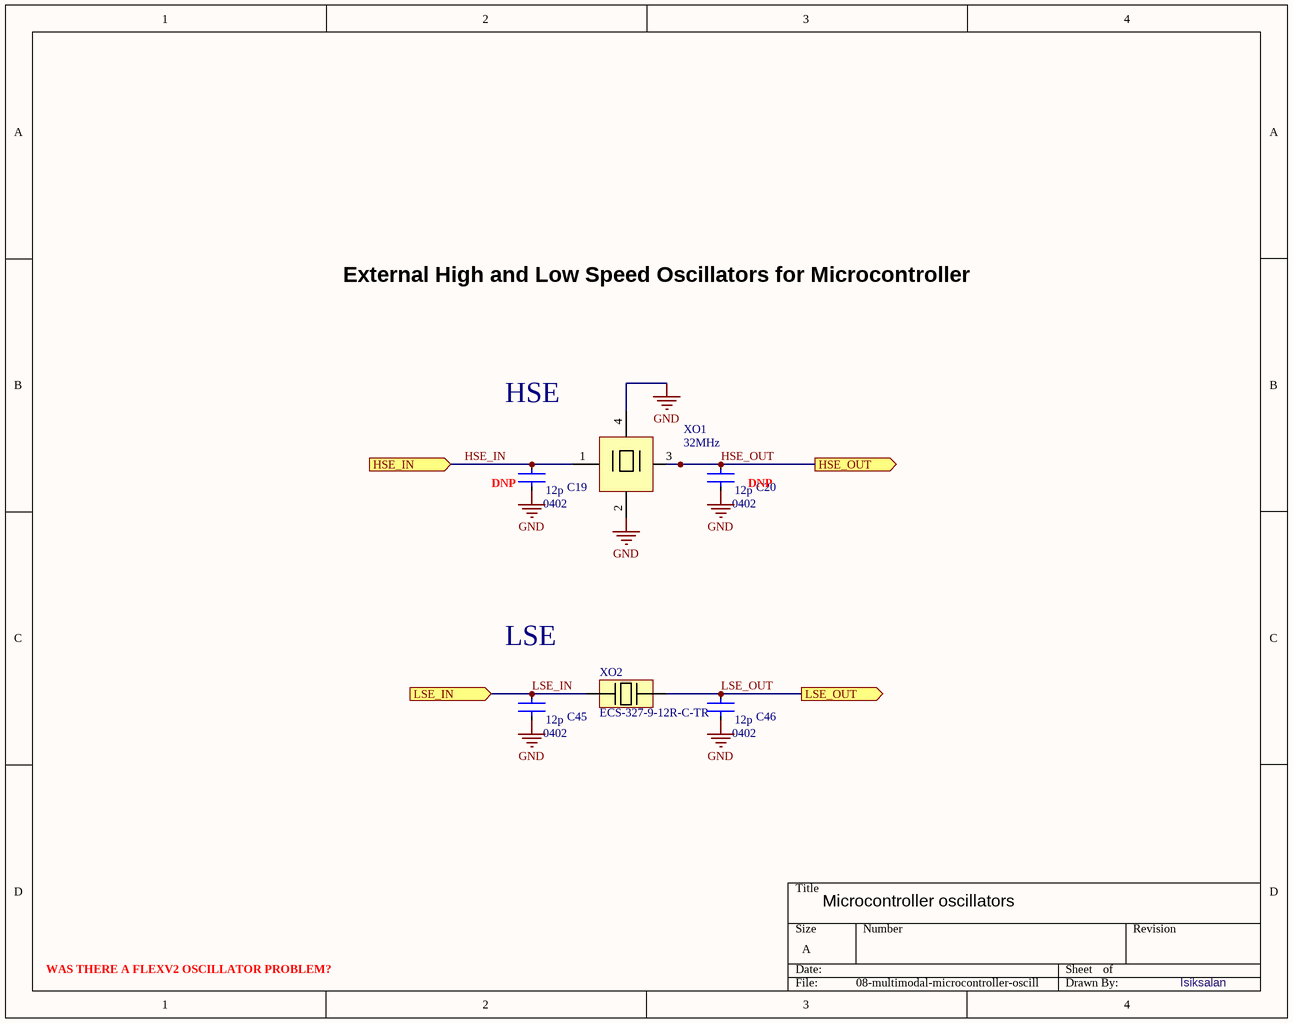
[diagram p10: 08-multimodal-microcontroller-oscillators.SchDoc]

### Parts
C19  CGA2B2C0G1H120J050BA  [CAPTDK0402]  (value not drawn)  (no BOM)
C20  CGA2B2C0G1H120J050BA  [CAPTDK0402]  (value not drawn)  (no BOM)
C45  CGA2B2C0G1H120J050BA  [CAPTDK0402]  (value not drawn)
C46  CGA2B2C0G1H120J050BA  [CAPTDK0402]  (value not drawn)
XO1  32MHz  [HSE-32MHZ]
XO2  ECS-327-9-12R-C-TR  [LSE-32K]

### Ports
HSE_IN (in, see 07-multimodal-microcontroller[7C]), HSE_OUT (out, see 07-multimodal-microcontroller[7D]), LSE_IN (in, see 07-multimodal-microcontroller[8C]), LSE_OUT (out, see 07-multimodal-microcontroller[8D])

### Nets
GND: C19.2 C20.2 C45.2 C46.2 XO1.2 XO1.4
HSE_IN: C19.1 XO1.1 ; port HSE_IN
HSE_OUT: C20.1 XO1.3 ; port HSE_OUT
LSE_IN: C45.1 XO2.1 ; port LSE_IN
LSE_OUT: C46.1 XO2.2 ; port LSE_OUT

### Notes on the sheet
- External High and Low Speed Oscillators for Microcontroller
- HSE
- (near C19) DNP
- (near C20) DNP
- LSE
- Microcontroller oscillators
- WAS THERE A FLEXV2 OSCILLATOR PROBLEM?
- Isiksalan
- (in symbol CGA2B2C0G1H120J050BA) 12p; 0402

### Library data of the parts
C19 C20 C45 C46 = CGA2B2C0G1H120J050BA: CAP CER 12PF 50V C0G 0402; Supplier 1: Digi-Key; Supplier Part Number 1: 445-5585-1-ND
XO1 = NX2016SA-32MHZ-EXS00A-CS06654: CRYSTAL 32MHZ 8PF 60R SMD; Manufacturer: NDK; Supplier 1: Digi-Key; Manufacturer Part Number: NX2016SA-32MHZ-EXS00A-CS06654; RoHS: No; Pricing 1: 1=0.58000, 10=0.48200, 50=0.43420, 100=0.38600, 500=0.36670, 1000=0.30880 (USD); Mount: Surface Mount; Case/Package: SMD/SMT; Min Operating Temperature: -40°C; Max Operating Temperature: 125°C; Packaging: Tape and Reel; Frequency: 32MHz; Load Capacitance: 8pF; ESR (Equivalent Series Resistance): 60R; Ratings: AEC-Q200; Supplier Part Number 1: 644-1373-1-ND
XO2 = ECS-327-9-12R-C-TR: Crystal 0.032768MHz ±10ppm (Tol) 9pF Flexural 70000Ohm Automotive 2-Pin Ultra Mini-CSMD T/R; Manufacturer: ECS International; Manufacturer Part Number: ECS-.327-9-12R-C-TR; Frequency: 32.768kHz; ESR (Equivalent Series Resistance): 70kR; Supplier 1: Digi-Key; RoHS: Yes; Stock 1: 152; Pricing 1: 1=0.79000, 10=0.65700, 50=0.59160, 100=0.52580, 500=0.49952, 1000=0.42064 (USD); Mount: Surface Mount; Case/Package: SMD/SMT; Min Operating Temperature: -40°C; Max Operating Temperature: 85°C; Packaging: Tape and Reel; Frequency Tolerance: 10ppm; Load Capacitance: 9pF; ComponentLink1URL: https://www.ecsxtal.com/store/pdf/ECX-12R.pdf?src-supplier=Digi-Key; ComponentLink1Description: https://www.ecsxtal.com/store/pdf/ECX-12R.pdf?src-supplier=Digi-Key; Supplier Part Number 1: XC2744CT-ND